# EAGLE design in3watch (EAGLE 6.4)

## Sheet 1 of 4: MCU
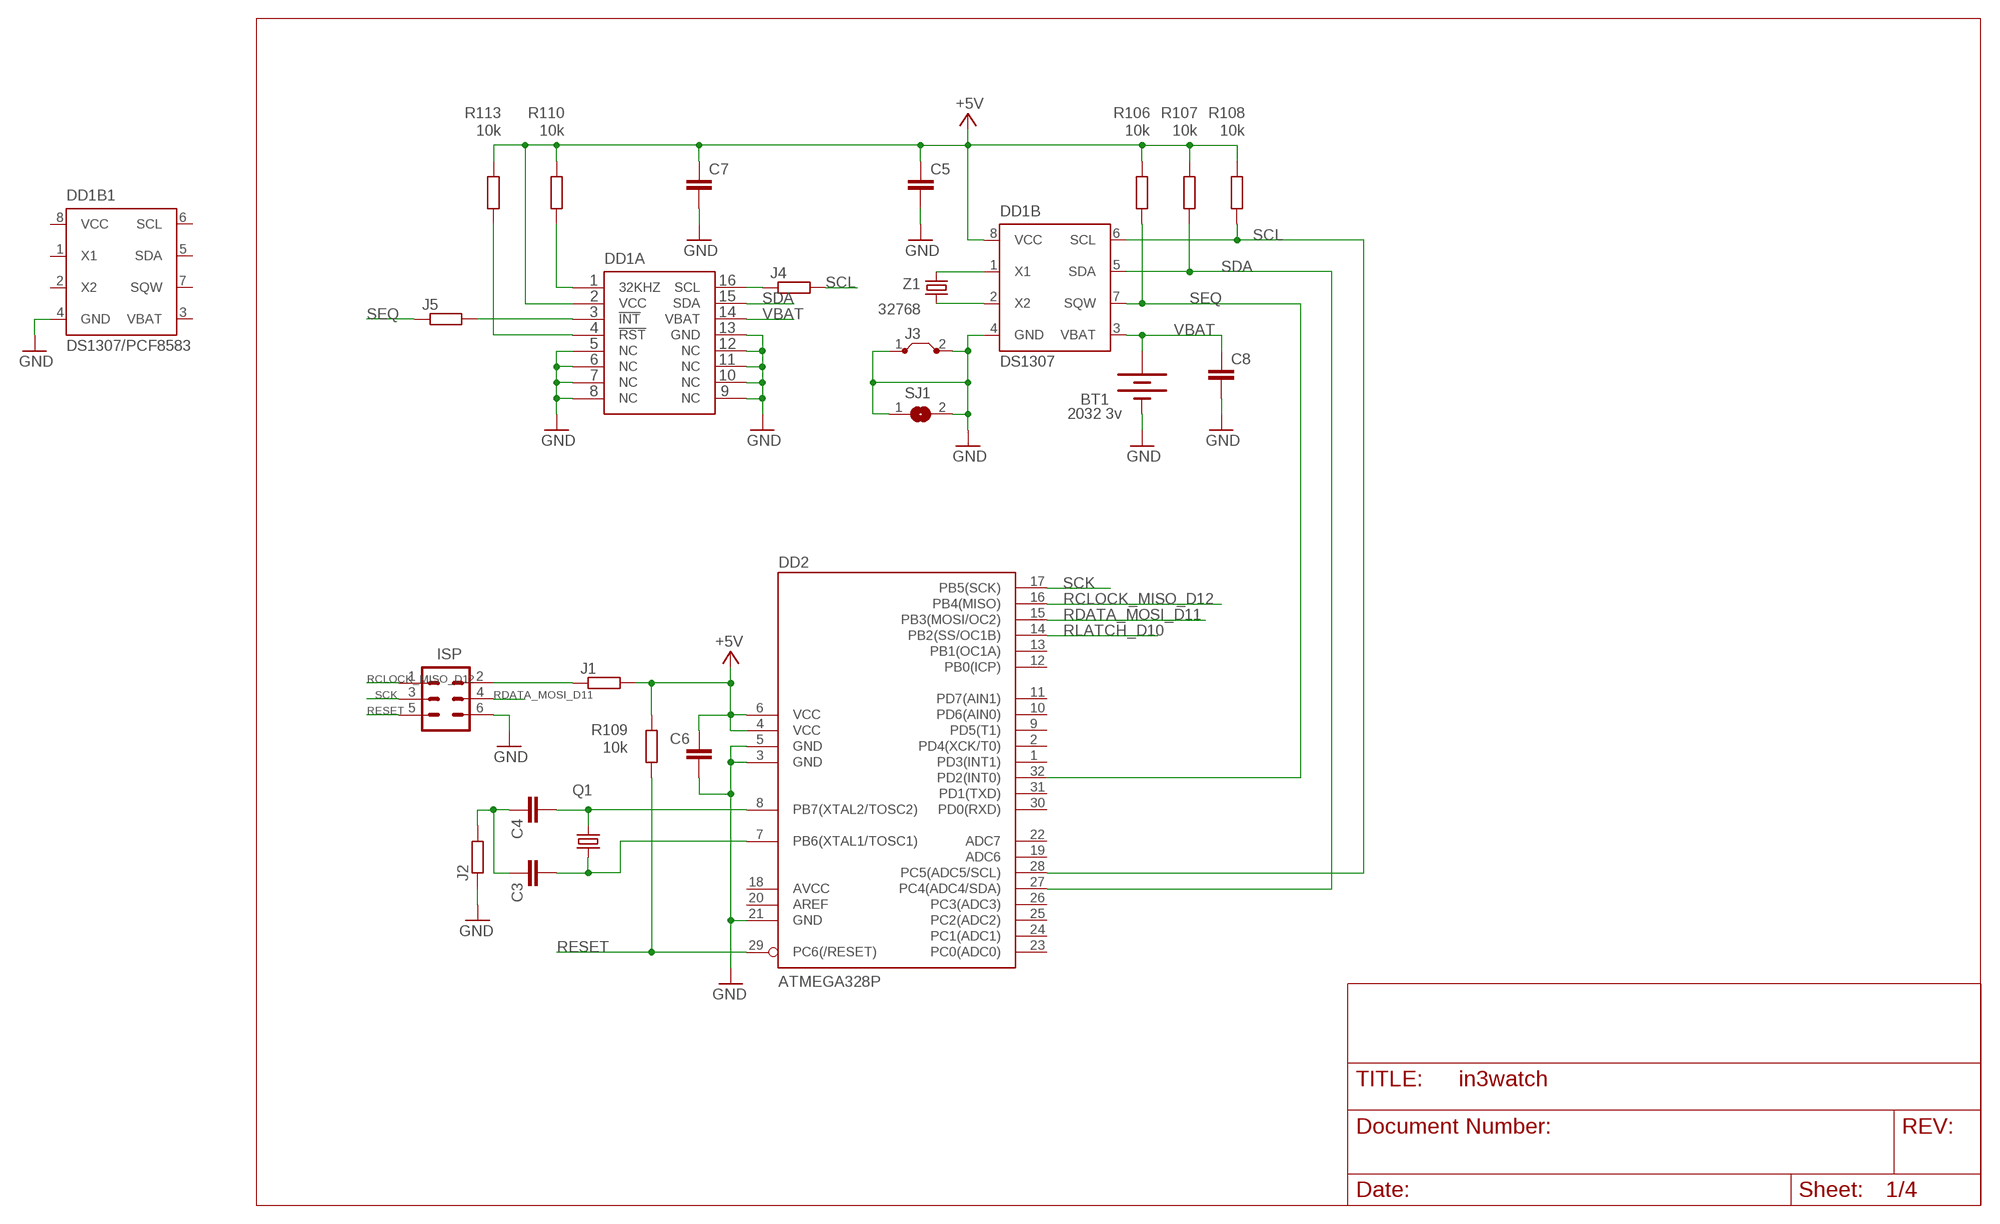
[diagram p0: schematic, sheet 1]

### Parts
BT1  2032 3v  BATTERY-20MM_PTH  [BATTCOM_20MM_PTH]
C3  C-EUC0805  [C0805]
C4  C-EUC0805  [C0805]
C5  C-EUC0805  [C0805]
C6  C-EUC0805  [C0805]
C7  C-EUC0805  [C0805]
C8  C-EUC3225  [C3225]
DD1A  DS3231SOIC-16W  [SOIC-16W]
DD1B  DS1307  [DIL08]
DD1B1  DS1307/PCF8583  [SO8-7_5+SOIC8]
DD2  ATMEGA328P  MEGA8-AI  [TQFP32-08]
ISP  MA03-2  [MA03-2]
J1  R-EU_R1206  [R1206]
J2  R-EU_R1206  [R1206]
J3  J5MM  [05]
J4  R-EU_R1206W  [R1206W]
J5  R-EU_R1206W  [R1206W]
Q1  CRYSTALHC49U70  [HC49U70]
R106  10k  R-EU_R0805  [R0805]
R107  10k  R-EU_R0805  [R0805]
R108  10k  R-EU_R0805  [R0805]
R109  10k  R-EU_R0805  [R0805]
R110  10k  R-EU_R0805  [R0805]
R113  10k  R-EU_R0805  [R0805]
SJ1  SJ  [SJ]
Z1  32768  FC-12M  [FC-12M]

### Nets
+5V: C5.1 C6.1 C7.1 DD1A.2(VCC) DD1B.8(VCC) DD2.4(VCC) DD2.6(VCC) J1.2 R106.2 R107.2 R108.2 R109.2 R110.2 R113.2 ; also sheet 2
+5VISP: ISP.2 J1.1
GND: BT1.2(-) C5.2 C6.2 C7.2 C8.2 DD1A.5(NC) DD1A.6(NC) DD1A.7(NC) DD1A.8(NC) DD1A.9(NC) DD1A.10(NC) DD1A.11(NC) DD1A.12(NC) DD1A.13(GND) DD1B1.4(GND) DD1B.4(GND) DD2.3(GND) DD2.5(GND) DD2.21(GND) ISP.6 J2.1 J3.1 J3.2 SJ1.1 SJ1.2 ; also sheet 2,4
N$31: DD1B.2(X2) Z1.P$1
N$33: DD1B.1(X1) Z1.P$2
N$72: C4.2 DD2.8(PB7(XTAL2/TOSC2)) Q1.1
N$76: C3.1 C4.1 J2.2
N$112: C3.2 DD2.7(PB6(XTAL1/TOSC1)) Q1.2
N$114: DD1A.1(32KHZ) R110.1
N$115: DD1A.4(!RST) R113.1
RCLOCK_MISO_D12: DD2.16(PB4(MISO)) ISP.1
RDATA_MOSI_D11: DD2.15(PB3(MOSI/OC2)) ISP.4
RESET: DD2.29(PC6(/RESET)) ISP.5 R109.1
RLATCH_D10: DD2.14(PB2(SS/OC1B))
SCK: DD2.17(PB5(SCK)) ISP.3
SCL: DD1B.6(SCL) DD2.28(PC5(ADC5/SCL)) J4.2 R108.1
SCL_J: DD1A.16(SCL) J4.1
SDA: DD1A.15(SDA) DD1B.5(SDA) DD2.27(PC4(ADC4/SDA)) R107.1
SEQ: DD1B.7(SQW) DD2.32(PD2(INT0)) J5.1 R106.1
SEQ_J: DD1A.3(!INT) J5.2
VBAT: BT1.1(+) C8.1 DD1A.14(VBAT) DD1B.3(VBAT)
Unconnected: DD1B1.1(X1) DD1B1.2(X2) DD1B1.3(VBAT) DD1B1.5(SDA) DD1B1.6(SCL) DD1B1.7(SQW) DD2.1(PD3(INT1)) DD2.2(PD4(XCK/T0)) DD2.9(PD5(T1)) DD2.10(PD6(AIN0)) DD2.11(PD7(AIN1)) DD2.12(PB0(ICP)) DD2.13(PB1(OC1A)) DD2.19(ADC6) DD2.20(AREF) DD2.22(ADC7) DD2.23(PC0(ADC0)) DD2.24(PC1(ADC1)) DD2.25(PC2(ADC2)) DD2.26(PC3(ADC3)) DD2.30(PD0(RXD)) DD2.31(PD1(TXD))

## Sheet 2 of 4: REG
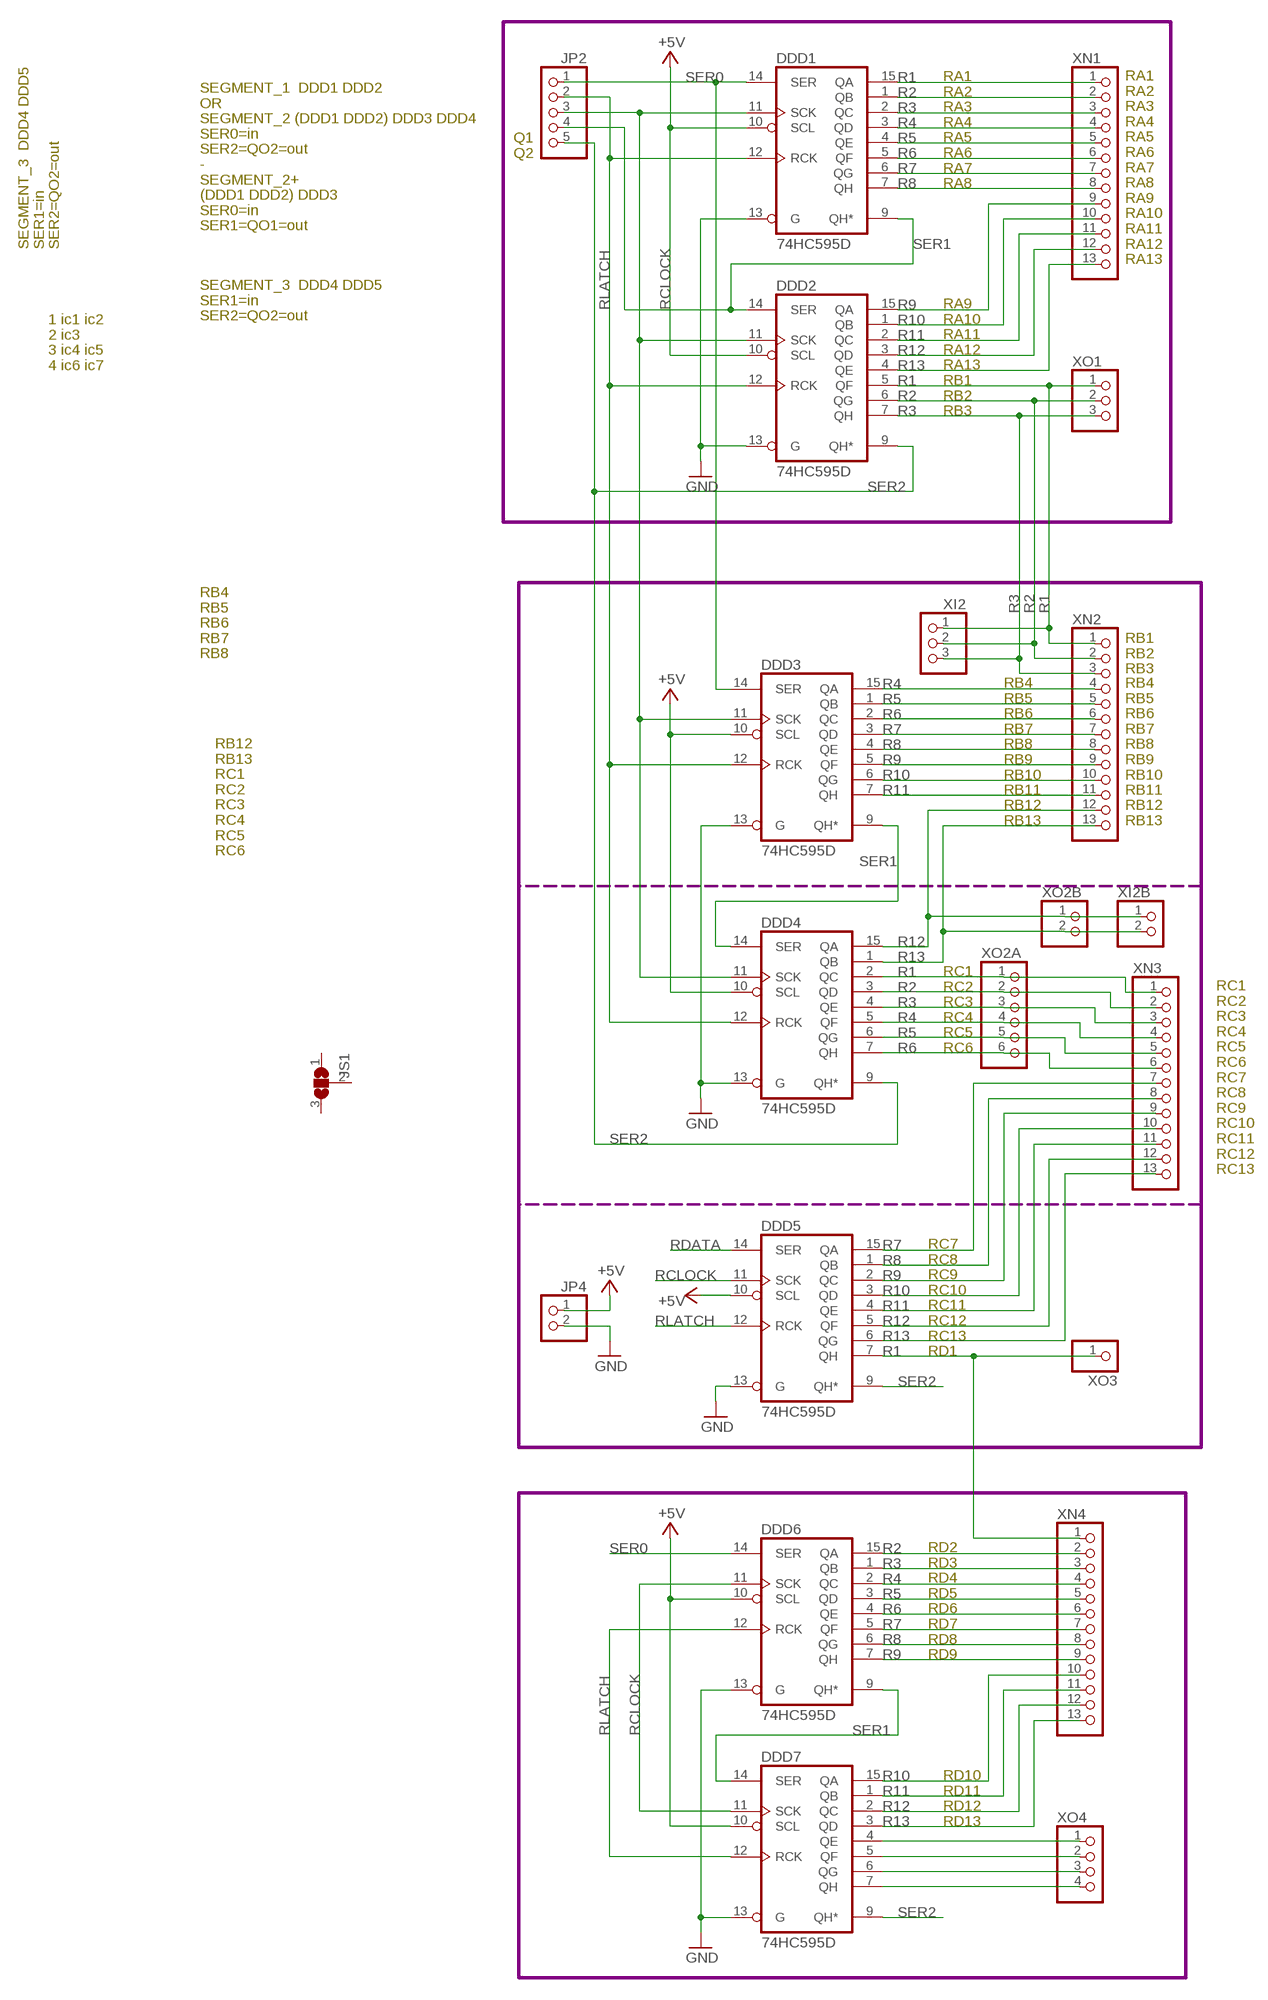
[diagram p1: schematic, sheet 2, part 1 of 2]
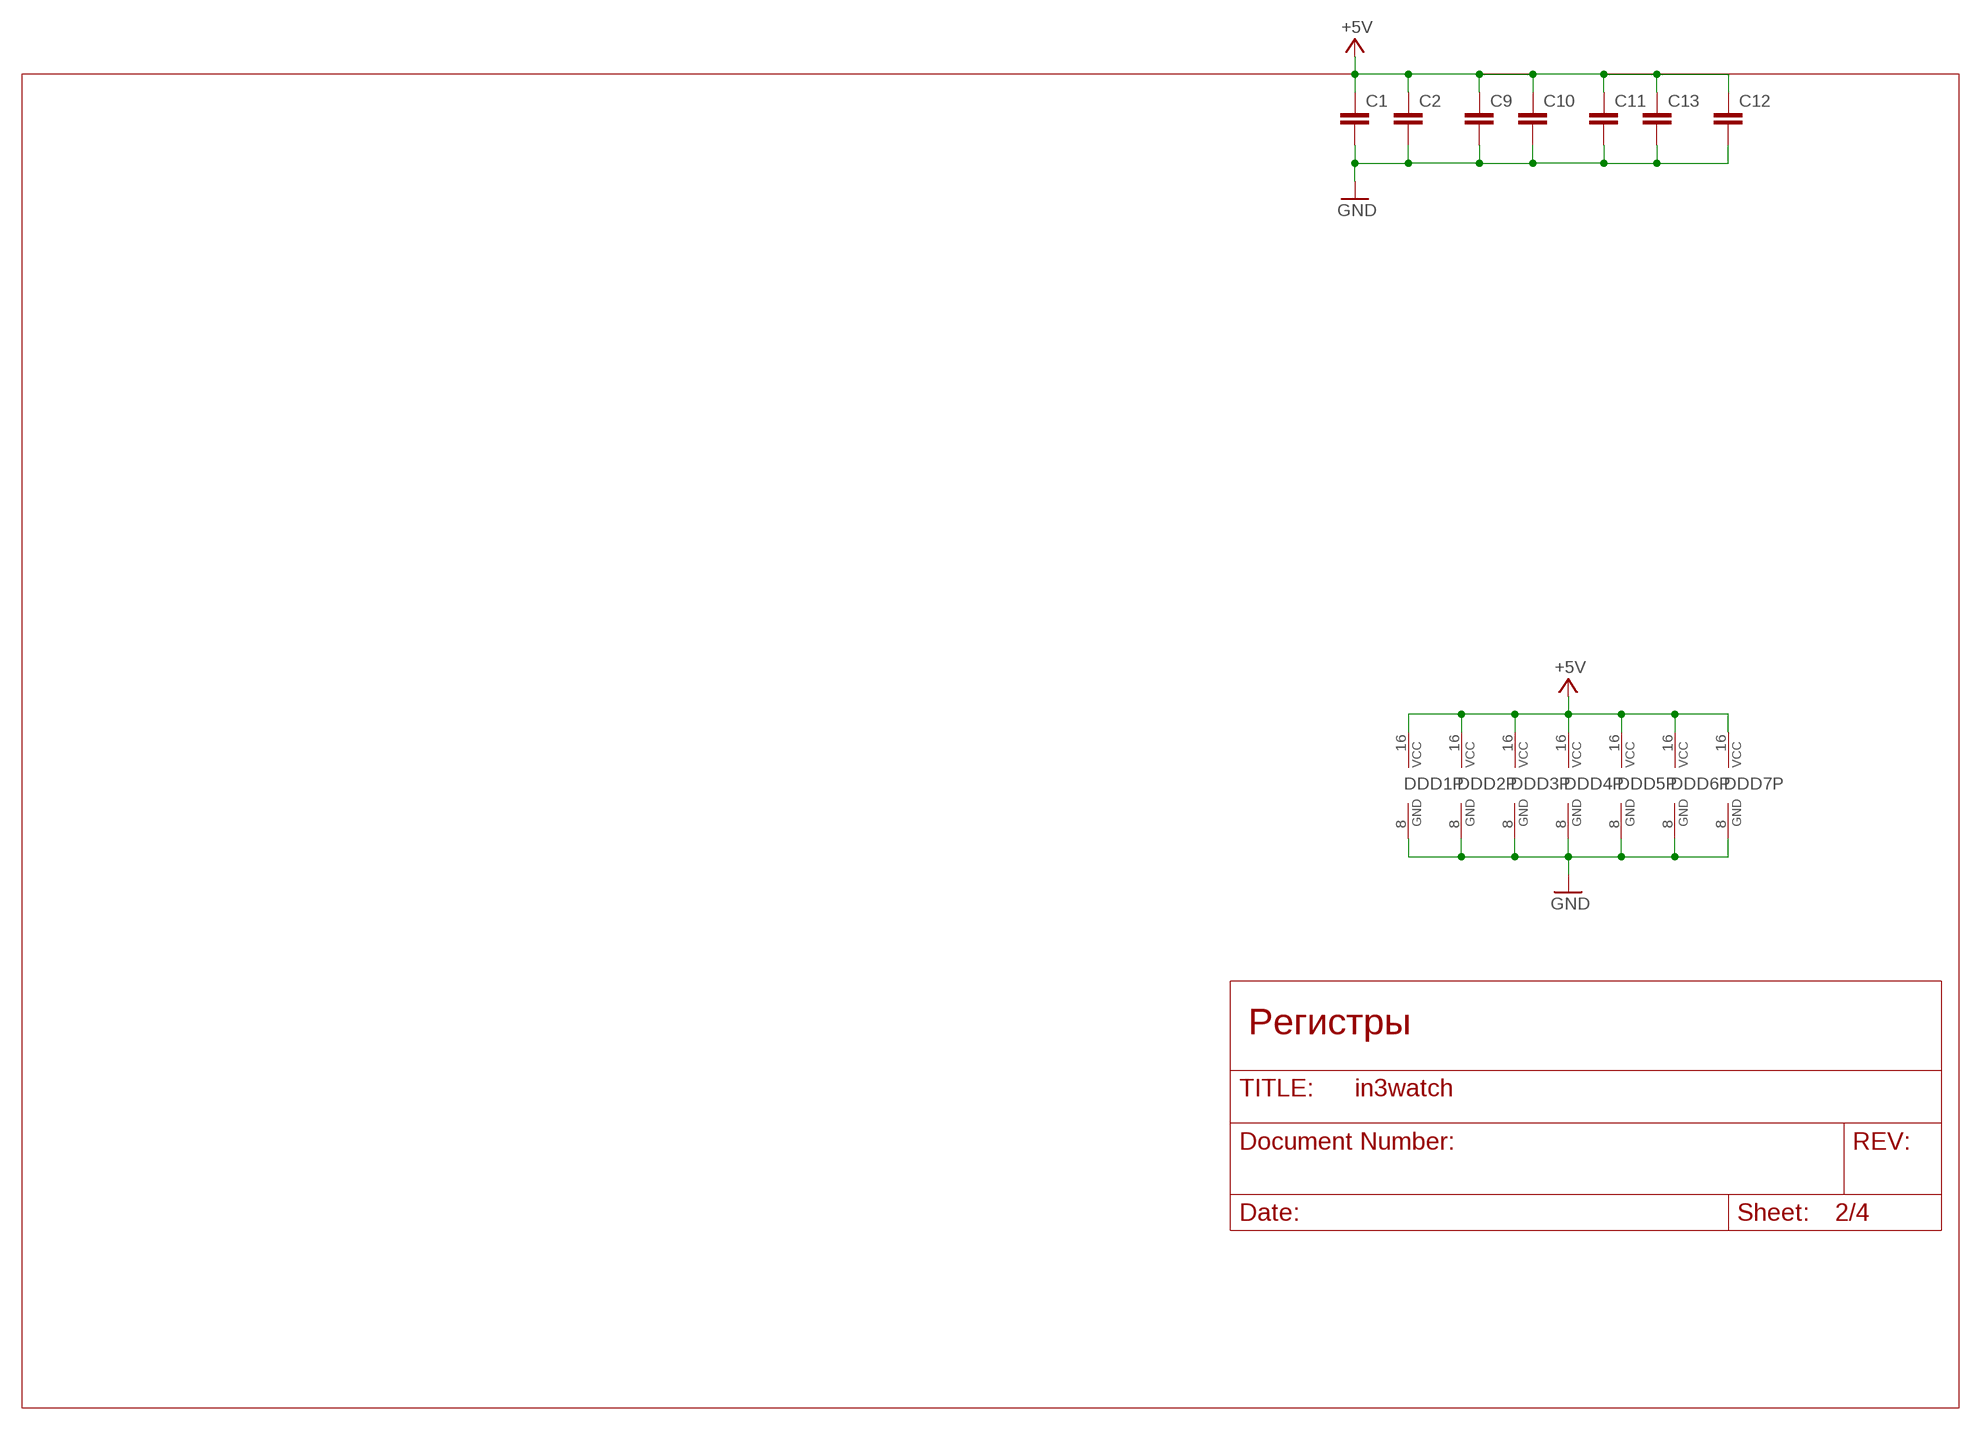
[diagram p2: schematic, sheet 2, part 2 of 2]

### Parts
C1  C-EUC0805  [C0805]
C2  C-EUC0805  [C0805]
C9  C-EUC0805  [C0805]
C10  C-EUC0805  [C0805]
C11  C-EUC0805  [C0805]
C12  C-EUC0805  [C0805]
C13  C-EUC0805  [C0805]
DDD1  74HC595D  [SO16]
DDD2  74HC595D  [SO16]
DDD3  74HC595D  [SO16]
DDD4  74HC595D  [SO16]
DDD5  74HC595D  [SO16]
DDD6  74HC595D  [SO16]
DDD7  74HC595D  [SO16]
JP2  PINHD-1X5  [1X05]
JP4  PINHD-1X2  [2X01]
JS1  SJ2W  [SJ_2]
XI2  PINHD-1X3  [1X03]
XI2B  PINHD-1X2/2  [1X02]
XN1  PINHD-1X13  [1X13]
XN2  PINHD-1X13  [1X13]
XN3  PINHD-1X13  [1X13]
XN4  PINHD-1X13  [1X13]
XO1  PINHD-1X3  [1X03]
XO2A  PINHD-1X6  [1X06]
XO2B  PINHD-1X2/2  [1X02]
XO3  PINHD-1X1  [1X01]
XO4  PINHD-1X4  [1X04]

### Nets
+5V: C1.1 C2.1 C9.1 C10.1 C11.1 C12.1 C13.1 DDD1.10(SCL) DDD1.16(VCC) DDD2.10(SCL) DDD2.16(VCC) DDD3.10(SCL) DDD3.16(VCC) DDD4.10(SCL) DDD4.16(VCC) DDD5.10(SCL) DDD5.16(VCC) DDD6.10(SCL) DDD6.16(VCC) DDD7.10(SCL) DDD7.16(VCC) JP4.1 ; also sheet 1
GND: C1.2 C2.2 C9.2 C10.2 C11.2 C12.2 C13.2 DDD1.8(GND) DDD1.13(G) DDD2.8(GND) DDD2.13(G) DDD3.8(GND) DDD3.13(G) DDD4.8(GND) DDD4.13(G) DDD5.8(GND) DDD5.13(G) DDD6.8(GND) DDD6.13(G) DDD7.8(GND) DDD7.13(G) JP4.2 ; also sheet 1,4
N$17: DDD7.4(QE) XO4.1
N$117: DDD7.5(QF) XO4.2
N$118: DDD7.6(QG) XO4.3
N$119: DDD7.7(QH) XO4.4
R1: DDD1.15(QA) DDD2.5(QF) DDD4.2(QC) DDD5.7(QH) XI2.1 XN1.1 XN2.1 XN3.1 XN4.1 XO1.1 XO2A.1 XO3.1
R2: DDD1.1(QB) DDD2.6(QG) DDD4.3(QD) DDD6.15(QA) XI2.2 XN1.2 XN2.2 XN3.2 XN4.2 XO1.2 XO2A.2
R3: DDD1.2(QC) DDD2.7(QH) DDD4.4(QE) DDD6.1(QB) XI2.3 XN1.3 XN2.3 XN3.3 XN4.3 XO1.3 XO2A.3
R4: DDD1.3(QD) DDD3.15(QA) DDD4.5(QF) DDD6.2(QC) XN1.4 XN2.4 XN3.4 XN4.4 XO2A.4
R5: DDD1.4(QE) DDD3.1(QB) DDD4.6(QG) DDD6.3(QD) XN1.5 XN2.5 XN3.5 XN4.5 XO2A.5
R6: DDD1.5(QF) DDD3.2(QC) DDD4.7(QH) DDD6.4(QE) XN1.6 XN2.6 XN3.6 XN4.6 XO2A.6
R7: DDD1.6(QG) DDD3.3(QD) DDD5.15(QA) DDD6.5(QF) XN1.7 XN2.7 XN3.7 XN4.7
R8: DDD1.7(QH) DDD3.4(QE) DDD5.1(QB) DDD6.6(QG) XN1.8 XN2.8 XN3.8 XN4.8
R9: DDD2.15(QA) DDD3.5(QF) DDD5.2(QC) DDD6.7(QH) XN1.9 XN2.9 XN3.9 XN4.9
R10: DDD2.1(QB) DDD3.6(QG) DDD5.3(QD) DDD7.15(QA) XN1.10 XN2.10 XN3.10 XN4.10
R11: DDD2.2(QC) DDD3.7(QH) DDD5.4(QE) DDD7.1(QB) XN1.11 XN2.11 XN3.11 XN4.11
R12: DDD2.3(QD) DDD4.15(QA) DDD5.5(QF) DDD7.2(QC) XI2B.1 XN1.12 XN2.12 XN3.12 XN4.12 XO2B.1
R13: DDD2.4(QE) DDD4.1(QB) DDD5.6(QG) DDD7.3(QD) XI2B.2 XN1.13 XN2.13 XN3.13 XN4.13 XO2B.2
RCLOCK: DDD1.11(SCK) DDD2.11(SCK) DDD3.11(SCK) DDD4.11(SCK) DDD5.11(SCK) DDD6.11(SCK) DDD7.11(SCK) JP2.3
RDATA: DDD5.14(SER)
RLATCH: DDD1.12(RCK) DDD2.12(RCK) DDD3.12(RCK) DDD4.12(RCK) DDD5.12(RCK) DDD6.12(RCK) DDD7.12(RCK) JP2.2
SER0: DDD1.14(SER) DDD3.14(SER) DDD6.14(SER) JP2.1
SER1: DDD1.9(QH*) DDD2.14(SER) DDD3.9(QH*) DDD4.14(SER) DDD6.9(QH*) DDD7.14(SER) JP2.4
SER2: DDD2.9(QH*) DDD4.9(QH*) DDD5.9(QH*) DDD7.9(QH*) JP2.5
Unconnected: JS1.1 JS1.2 JS1.3

### Notes on the sheet
- SEGMENT_1  DDD1 DDD2
  OR 
  SEGMENT_2 (DDD1 DDD2) DDD3 DDD4
  SER0=in
  SER2=QO2=out
  -
  SEGMENT_2+
  (DDD1 DDD2) DDD3
  SER0=in
  SER1=QO1=out
- Q1
  Q2
- RA1
  RA2
  RA3
  RA4
  RA5
  RA6
  RA7
  RA8
- SEGMENT_3  DDD4 DDD5
  SER1=in
  SER2=QO2=out
- RA1
  RA2
  RA3
  RA4
  RA5
  RA6
  RA7
  RA8
  RA9
  RA10
  RA11
  RA12
  RA13
- SEGMENT_3  DDD4 DDD5
  SER1=in
  SER2=QO2=out
- 1 ic1 ic2
  2 ic3 
  3 ic4 ic5
  4 ic6 ic7
- RA9
  RA10
  RA11
  RA12
  RA13
  RB1
  RB2
  RB3
- RB4
  RB5
  RB6
  RB7
  RB8
- RB1
  RB2
  RB3
- Регистры
- RB4
  RB5
  RB6
  RB7
  RB8
  RB9
  RB10
  RB11
- RB4
  RB5
  RB6
  RB7
  RB8
  RB9
  RB10
  RB11
- RB12
  RB13
- RB12
  RB13
- RB12
  RB13
  RС1
  RС2
  RС3
  RС4
  RС5
  RС6
- RС1
  RС2
  RС3
  RС4
  RС5
  RС6
- RС1
  RС2
  RС3
  RС4
  RС5
  RС6
  RC7
  RC8
  RC9
  RC10
  RC11
  RC12
  RC13
- RC7
  RC8
  RC9
  RC10
  RC11
  RC12
  RC13
  RD1
- RD2
  RD3
  RD4
  RD5
  RD6
  RD7
  RD8
  RD9
- RD10
  RD11
  RD12
  RD13

## Sheet 3 of 4: DSPL
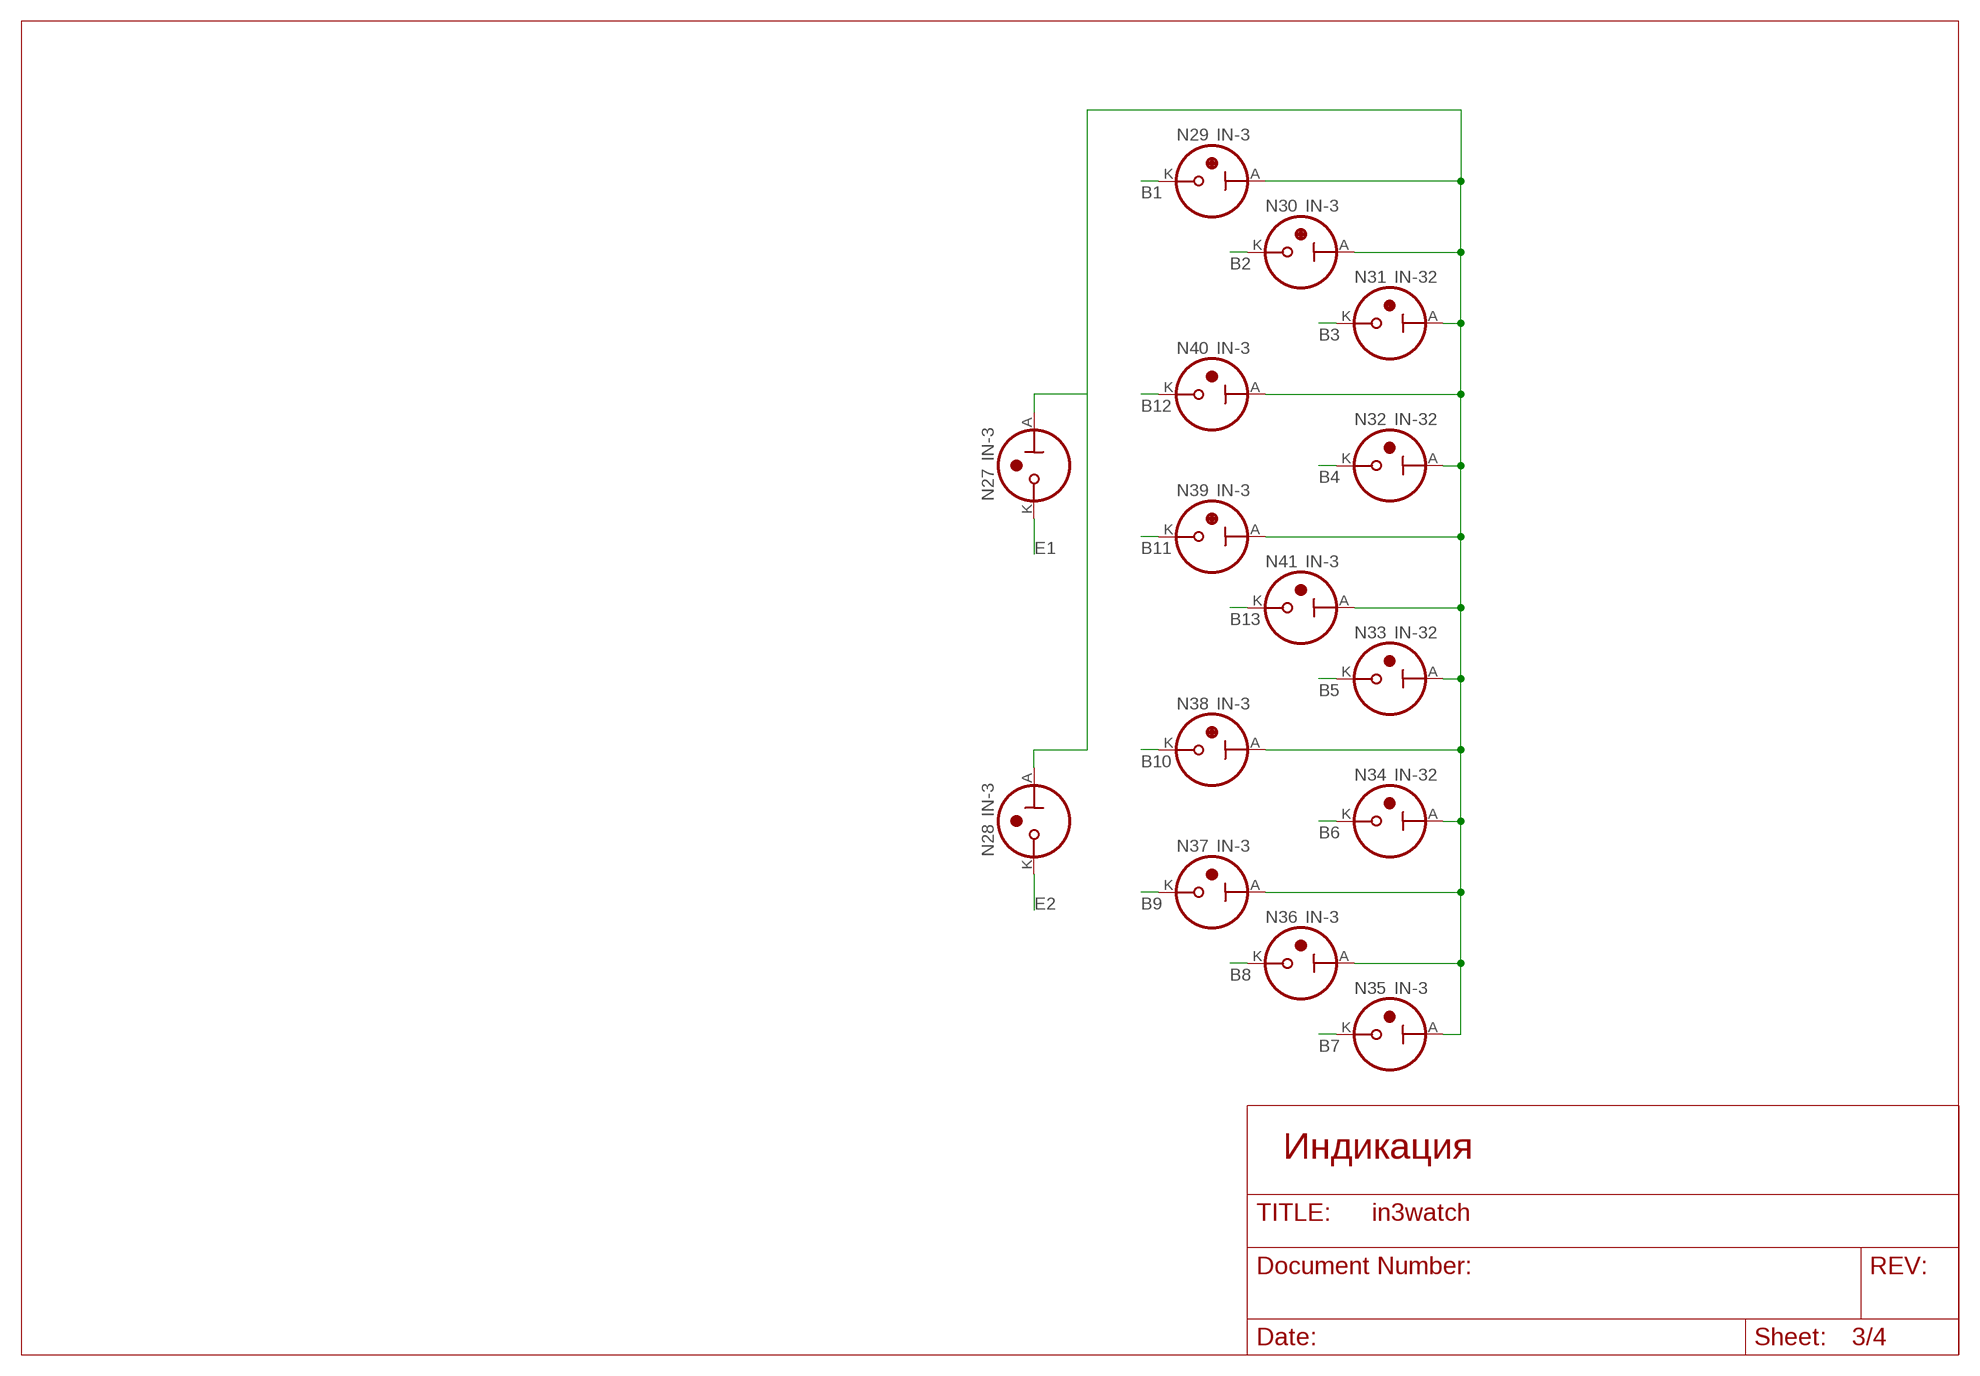
[diagram p3: schematic, sheet 3]

### Parts
N27  IN-3  [IN-3]
N28  IN-3  [IN-3]
N29  IN-3  [IN-3]
N30  IN-3  [IN-3]
N31  IN-32  [IN-3-2]
N32  IN-32  [IN-3-2]
N33  IN-32  [IN-3-2]
N34  IN-32  [IN-3-2]
N35  IN-3  [IN-3]
N36  IN-3  [IN-3]
N37  IN-3  [IN-3]
N38  IN-3  [IN-3]
N39  IN-3  [IN-3]
N40  IN-3  [IN-3]
N41  IN-3  [IN-3]

### Nets
+100V: N27.A N28.A N29.A N30.A N31.A N32.A N33.A N34.A N35.A N36.A N37.A N38.A N39.A N40.A N41.A
B1: N29.K ; also sheet 4
B2: N30.K ; also sheet 4
B3: N31.K ; also sheet 4
B4: N32.K ; also sheet 4
B5: N33.K ; also sheet 4
B6: N34.K ; also sheet 4
B7: N35.K ; also sheet 4
B8: N36.K ; also sheet 4
B9: N37.K ; also sheet 4
B10: N38.K ; also sheet 4
B11: N39.K ; also sheet 4
B12: N40.K ; also sheet 4
B13: N41.K
E1: N27.K ; also sheet 4
E2: N28.K ; also sheet 4

### Notes on the sheet
- Индикация

## Sheet 4 of 4: SW.1
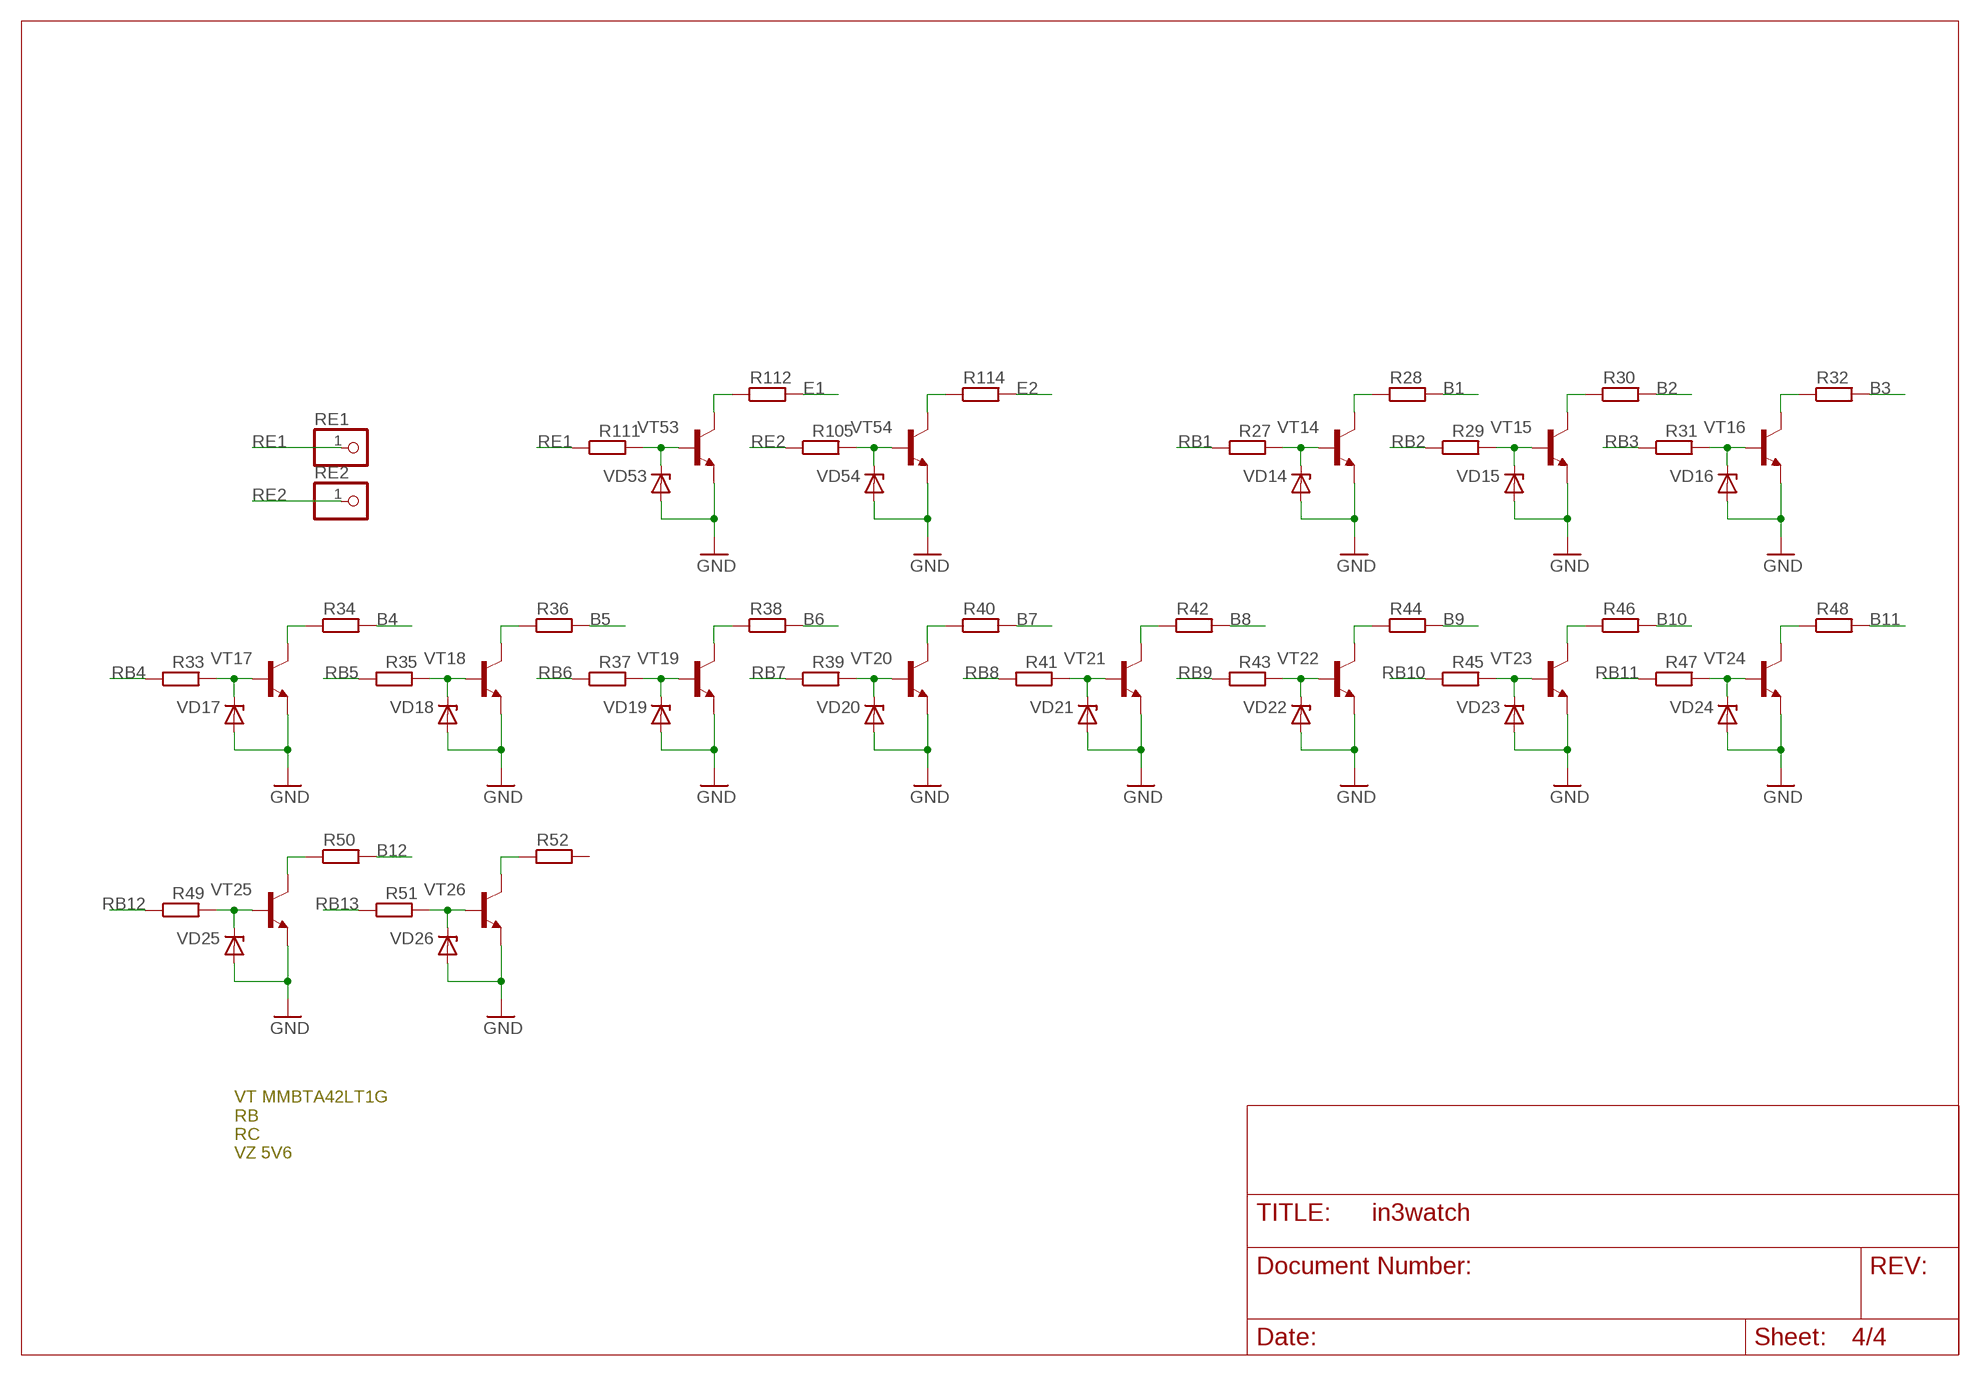
[diagram p4: schematic, sheet 4]

### Parts
R27  R-EU_R0805  [R0805]
R28  R-EU_0207/12  [0207/12]
R29  R-EU_R0805  [R0805]
R30  R-EU_0207/12  [0207/12]
R31  R-EU_R0805  [R0805]
R32  R-EU_0207/12  [0207/12]
R33  R-EU_R0805  [R0805]
R34  R-EU_0207/12  [0207/12]
R35  R-EU_M1206  [M1206]
R36  R-EU_0207/12  [0207/12]
R37  R-EU_R0805  [R0805]
R38  R-EU_0207/12  [0207/12]
R39  R-EU_R0805  [R0805]
R40  R-EU_0207/12  [0207/12]
R41  R-EU_R1206W  [R1206W]
R42  R-EU_0207/12  [0207/12]
R43  R-EU_R1206W  [R1206W]
R44  R-EU_0207/12  [0207/12]
R45  R-EU_R1206W  [R1206W]
R46  R-EU_0207/12  [0207/12]
R47  R-EU_R0805  [R0805]
R48  R-EU_0207/10  [0207/10]
R49  R-EU_R0805  [R0805]
R50  R-EU_0207/12  [0207/12]
R51  R-EU_R0805  [R0805]
R52  R-EU_0207/12  [0207/12]
R105  R-EU_R0805  [R0805]
R111  R-EU_R0805  [R0805]
R112  R-EU_M0805  [M0805]
R114  R-EU_M0805  [M0805]
RE1  PINHD-1X1  [1X01]
RE2  PINHD-1X1  [1X01]
VD14  ZENER-DIODESOD80C  [SOD80C]
VD15  ZENER-DIODESOD80C  [SOD80C]
VD16  ZENER-DIODESOD80C  [SOD80C]
VD17  ZENER-DIODESOD80C  [SOD80C]
VD18  ZENER-DIODESOD80C  [SOD80C]
VD19  ZENER-DIODESOD80C  [SOD80C]
VD20  ZENER-DIODESOD80C  [SOD80C]
VD21  ZENER-DIODESOD80C  [SOD80C]
VD22  ZENER-DIODESOD80C  [SOD80C]
VD23  ZENER-DIODESOD80C  [SOD80C]
VD24  ZENER-DIODESOD80C  [SOD80C]
VD25  ZENER-DIODESOD80C  [SOD80C]
VD26  ZENER-DIODESOD80C  [SOD80C]
VD53  ZENER-DIODESOD80C  [SOD80C]
VD54  ZENER-DIODESOD80C  [SOD80C]
VT14  BC849SMD  [SOT23-BEC]
VT15  BC849SMD  [SOT23-BEC]
VT16  BC849SMD  [SOT23-BEC]
VT17  BC849SMD  [SOT23-BEC]
VT18  BC849SMD  [SOT23-BEC]
VT19  BC849SMD  [SOT23-BEC]
VT20  BC849SMD  [SOT23-BEC]
VT21  BC849SMD  [SOT23-BEC]
VT22  BC849SMD  [SOT23-BEC]
VT23  BC849SMD  [SOT23-BEC]
VT24  BC849SMD  [SOT23-BEC]
VT25  BC849SMD  [SOT23-BEC]
VT26  BC849SMD  [SOT23-BEC]
VT53  BC849SMD  [SOT23-BEC]
VT54  BC849SMD  [SOT23-BEC]

### Nets
B1: R28.2 ; also sheet 3
B2: R30.2 ; also sheet 3
B3: R32.2 ; also sheet 3
B4: R34.2 ; also sheet 3
B5: R36.2 ; also sheet 3
B6: R38.2 ; also sheet 3
B7: R40.2 ; also sheet 3
B8: R42.2 ; also sheet 3
B9: R44.2 ; also sheet 3
B10: R46.2 ; also sheet 3
B11: R48.2 ; also sheet 3
B12: R50.2 ; also sheet 3
E1: R112.2 ; also sheet 3
E2: R114.2 ; also sheet 3
GND: VD14.A VD15.A VD16.A VD17.A VD18.A VD19.A VD20.A VD21.A VD22.A VD23.A VD24.A VD25.A VD26.A VD53.A VD54.A VT14.E VT15.E VT16.E VT17.E VT18.E VT19.E VT20.E VT21.E VT22.E VT23.E VT24.E VT25.E VT26.E VT53.E VT54.E ; also sheet 1,2
N$3: R34.1 VT17.C
N$16: R28.1 VT14.C
N$30: R27.2 VD14.C VT14.B
N$32: R33.2 VD17.C VT17.B
N$34: R30.1 VT15.C
N$35: R29.2 VD15.C VT15.B
N$36: R32.1 VT16.C
N$37: R31.2 VD16.C VT16.B
N$38: R36.1 VT18.C
N$39: R35.2 VD18.C VT18.B
N$40: R38.1 VT19.C
N$41: R37.2 VD19.C VT19.B
N$42: R40.1 VT20.C
N$43: R39.2 VD20.C VT20.B
N$44: R42.1 VT21.C
N$45: R41.2 VD21.C VT21.B
N$46: R44.1 VT22.C
N$47: R43.2 VD22.C VT22.B
N$48: R46.1 VT23.C
N$49: R45.2 VD23.C VT23.B
N$50: R48.1 VT24.C
N$51: R47.2 VD24.C VT24.B
N$52: R50.1 VT25.C
N$53: R49.2 VD25.C VT25.B
N$54: R52.1 VT26.C
N$55: R51.2 VD26.C VT26.B
N$73: R112.1 VT53.C
N$84: R111.2 VD53.C VT53.B
N$113: R114.1 VT54.C
N$116: R105.2 VD54.C VT54.B
RB1: R27.1
RB2: R29.1
RB3: R31.1
RB4: R33.1
RB5: R35.1
RB6: R37.1
RB7: R39.1
RB8: R41.1
RB9: R43.1
RB10: R45.1
RB11: R47.1
RB12: R49.1
RB13: R51.1
RE1: R111.1 RE1.1
RE2: R105.1 RE2.1
Unconnected: R52.2

### Notes on the sheet
- VT MMBTA42LT1G
  RB
  RC
  VZ 5V6

## Power pins joined to a net without a drawn wire
AVCC: DD2.18(AVCC)
VCC: DD1B1.8(VCC)

## Library data of the parts
BT1 = SparkFun-Batteries:BATTERY: Battery - Single Cell A variety of battery chemistries, sizes, and footprints. Device List: 20MM_PTH - Coin Cell Battery Holder - 20mm (PTH) <https://www.sparkfun.com/products/783> 6.8MM_PTH - Coin Cell Battery Holder - 6.8MM(SMD) <https://www.digikey.com/product-detail/en/seiko-instruments/MS621FE-FL11E/728-1057-ND/1889208?WT.srch=1&gclid=CNOQ5a6LzdQCFZS2wAodXCkE0g> 12MM_SMD - Coin Cell Battery Holder - 12mm (SMD) <https://www.sparkfun.com/products/10592> 12MM_PTH - Coin Cell Battery Holder - 12mm (PTH) <https://www.sparkfun.com/products/7948> 20MM_SMD - 20mm Coin Cell Battery Holder (SMD) (2 legs) Used on the Big Time Watch Kit <https://www.sparkfun.com/products/11734> 20MM_SMD_4LEGS - Coin Cell Battery Holder - 20mm (SMD) <https://www.sparkfun.com/products/11892> 20MM_SMD_4LEGS_OVERPASTE - Coin Cell Battery Holder - 20mm (SMD) <https://www.sparkfun.com/products/11892> (Over-paste on the legs) 24.5MM_PTH - Coin Cell Battery Holder - 24.5mm (PTH) <https://www.sparkfun.com/products/8863> 9V - 9V Battery Holder - PC Mount Used on the SparkFun SparkPunk Sound Kit <https://www.sparkfun.com/products/11177> and SparkFun SparkPunk Sequencer Kit <https://www.sparkfun.com/products/12707> 18650 - Battery Holder - 18650 (PTH) <https://www.sparkfun.com/products/13113> AA - Battery Holder - 1xAA (PTH) <https://www.sparkfun.com/products/7949> AAA - Battery Holder - 1xAAA (PTH) <https://www.sparkfun.com/products/12718> AA_KIT - Battery Holder - 1xAA (PTH) <https://www.sparkfun.com/products/7949> Special kit package - pads only have exposed copper on one side of the board. AAA_KIT - Battery Holder - 1xAAA (PTH) <https://www.sparkfun.com/products/12718> Special kit package - pads only have exposed copper on one side of the board.; PROD_ID: BATT-09031; SF_SKU: PRT-00783
C1-C13 = rcl:C-EU: CAPACITOR, European symbol
DD1A = DS3231_industrialberry:DS3231
DD1B DD1B1 = ds1307_pcf8583:DS1307: I2C-Bus CLOCK/CALENDAR
DD2 = atmel:MEGA8: MICROCONTROLLER 8 Kbytes FLASH, 1 kbytes SRAM, 512 bytes EEPROM, USART, 6-channel 10 bit ADC, 2-channel 8 bit ADC Pin compatible with Atmega48, ATMega88, ATMega168 Source: avr.lbr; MPN: ATMEGA8-16AU; OC_FARNELL: 9171371; OC_NEWARK: 73M8863
DDD1-DDD7 = 74xx-eu:74*595: 8-bit SHIFT REGISTER, output latch
ISP = con-lstb:MA03-2: PIN HEADER
J1 J2 J4 J5 R27-R52 R105-R114 = rcl:R-EU_: RESISTOR, European symbol
J3 = in3wlbr:J: Bridge
JP2 = Разъёмы штырьковые 2.54мм:PINHD-1X5: PIN HEADER
JP4 XI2B XO2B = Разъёмы штырьковые 2.54мм:PINHD-1X2: PIN HEADER
JS1 = jumper:SJ2W: SMD solder JUMPER
N27-N30 N35-N41 = in3:IN-3: IN-3: nixie bulb
N31-N34 = in3-mod:IN-3: IN-3: nixie bulb
Q1 = crystal:CRYSTAL: CRYSTAL; OC_FARNELL: unknown; OC_NEWARK: unknown
RE1 RE2 = pinhead:PINHD-1X1: PIN HEADER
SJ1 = jumper:SJ: SMD solder JUMPER
VD14-VD26 VD53 VD54 = diode:ZENER-DIODE: Z-Diode
VT14-VT26 VT53 VT54 = transistor-npn:BC849*: NPN Transistor
XI2 XO1 = Разъёмы штырьковые 2.54мм:PINHD-1X3: PIN HEADER
XN1-XN4 = Разъёмы штырьковые 2.54мм:PINHD-1X13: PIN HEADER
XO2A = Разъёмы штырьковые 2.54мм:PINHD-1X6: PIN HEADER
XO3 = Разъёмы штырьковые 2.54мм:PINHD-1X1: PIN HEADER
XO4 = Разъёмы штырьковые 2.54мм:PINHD-1X4: PIN HEADER
Z1 = zq:FC-12M: kHz RANGE CRYSTAL UNIT LOW PROFILE SMD Source: Epson Toyocom FC-12M.pdf

## Board
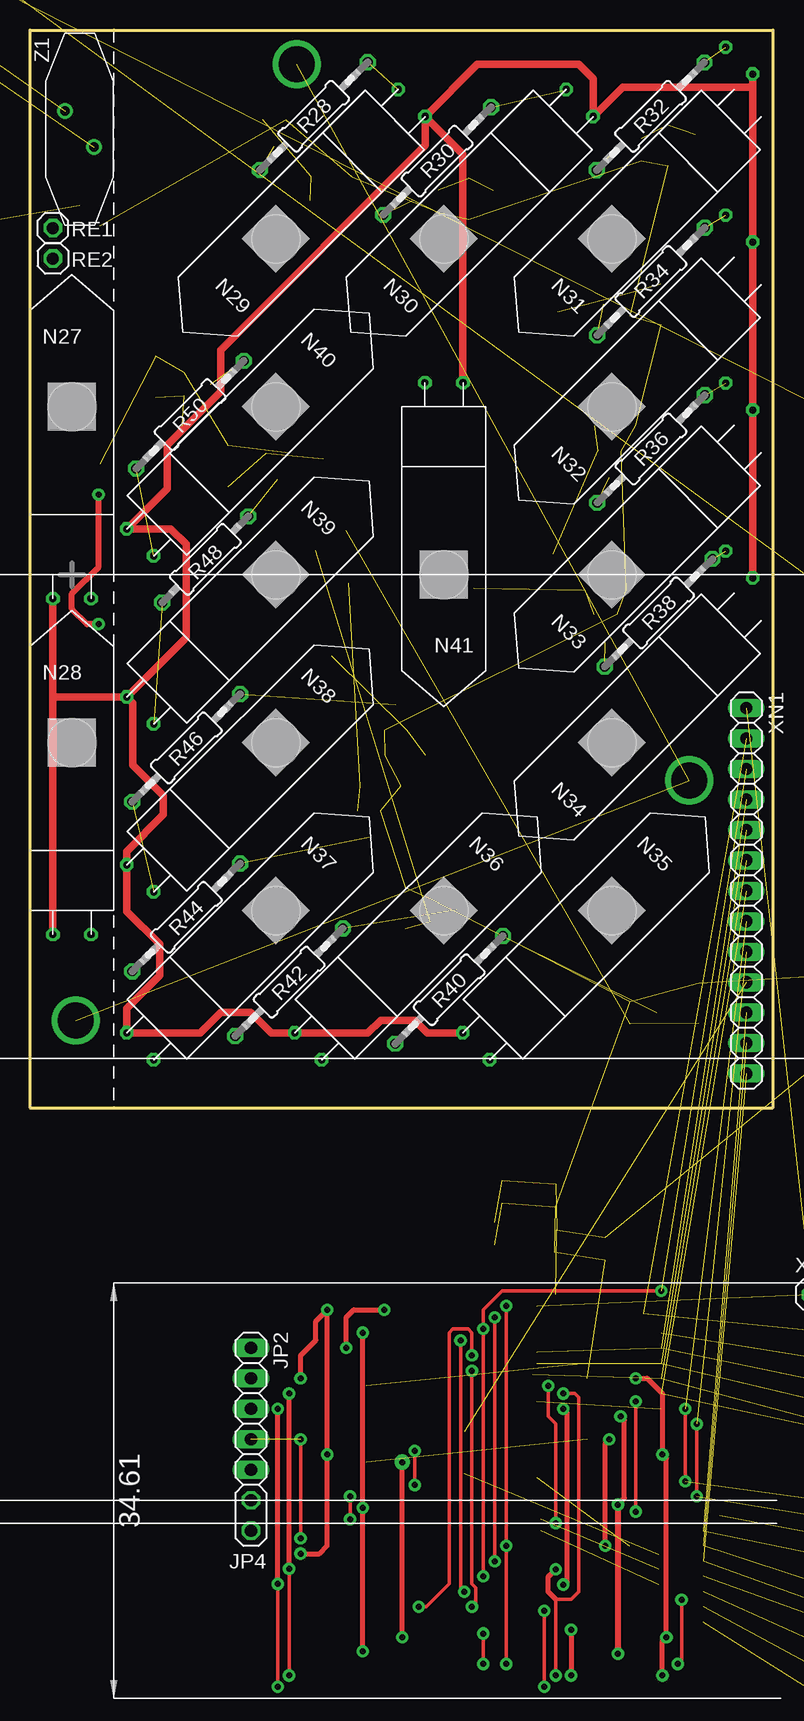
[diagram p5: board, top side]
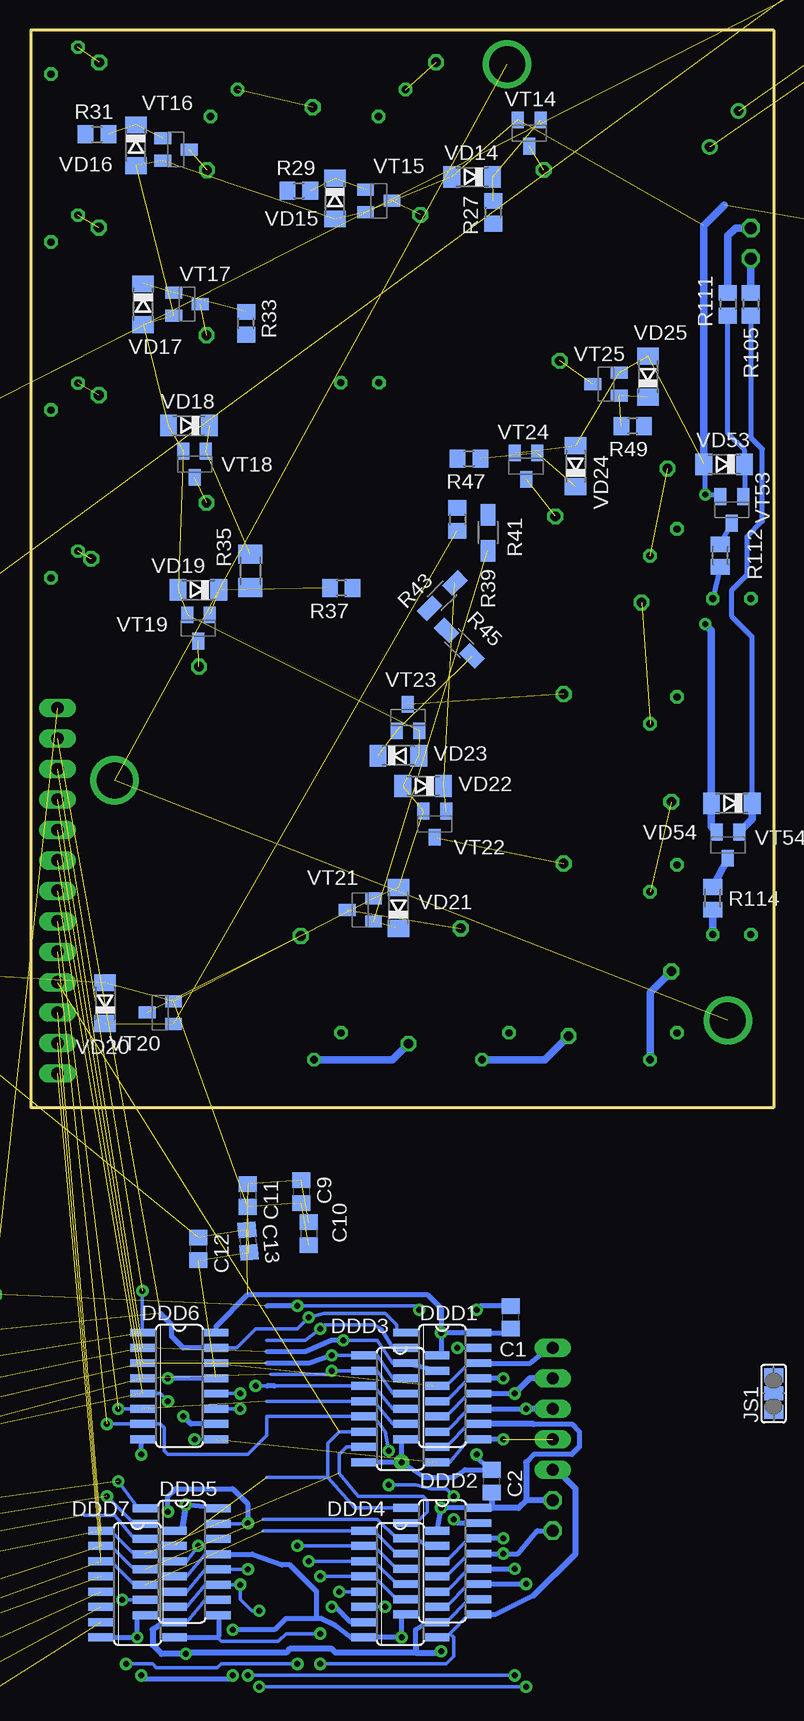
[diagram p6: board, bottom side, seen from below]

Size 61.91 x 89.85 mm. Coordinates in mm from the lower left corner, seen from the top.
Outline: 0,89.85 6.99,89.85 61.91,89.85 61.91,0 6.99,0 0,0 0,89.85
Copper layers (1*16): Top 0.035mm / dielectric 1.5mm / Bottom 0.035mm
Design rules "default_P": minimum track width 10mil, minimum drill 0.5mm, track to track 8mil, track to pad 8mil, pad to pad 8mil, via to via 8mil, smd to smd 8mil, copper to edge 40mil, drill to drill 8mil, minimum pad ring 10mil, minimum via ring 8mil, stop-mask expansion 4mil, vias tented up to drill 0mil, thermal gap 10mil

### Footprints (pad centres in the part's own frame; a part is rotated, then mirrored left to right if it is on the bottom)
BATTCOM_20MM_PTH = drill 1.3: 1 11.85,0; 2 -8.15,0
C0805 = smd 1.3 x 1.5: 1 -0.95,0; 2 0.95,0
C3225 = smd 1.6 x 2.7: 1 -1.4,0; 2 1.4,0
SOIC-16W = smd 0.6 x 2.2: 1 -4.445,-4.6; 2 -3.175,-4.6; 3 -1.905,-4.6; 4 -0.635,-4.6; 5 0.635,-4.6; 6 1.905,-4.6; 7 3.175,-4.6; 8 4.445,-4.6; 9 4.445,4.6; 10 3.175,4.6; 11 1.905,4.6; 12 0.635,4.6; 13 -0.635,4.6; 14 -1.905,4.6; 15 -3.175,4.6; 16 -4.445,4.6
DIL08 = drill 0.813 square: 1 -3.81,-3.81 | drill 0.813 octagon: 2 -1.27,-3.81; 3 1.27,-3.81; 4 3.81,-3.81; 5 3.81,3.81; 6 1.27,3.81; 7 -1.27,3.81 | drill 0.813: 8 -3.81,3.81
SO8-7_5+SOIC8 = smd 0.8 x 4.345: 1 -1.905,-3.672; 2 -0.635,-3.672; 3 0.635,-3.672; 4 1.905,-3.672; 5 1.905,3.672; 6 0.635,3.672; 7 -0.635,3.672; 8 -1.905,3.672
TQFP32-08 = smd 1.27 x 0.559: 1 -4.293,2.8; 2 -4.293,2; 3 -4.293,1.2; 4 -4.293,0.4; 5 -4.293,-0.4; 6 -4.293,-1.2; 7 -4.293,-2; 8 -4.293,-2.8; 17 4.293,-2.8; 18 4.293,-2; 19 4.293,-1.2; 20 4.293,-0.4; 21 4.293,0.4; 22 4.293,1.2; 23 4.293,2; 24 4.293,2.8 | smd 0.559 x 1.27: 9 -2.8,-4.293; 10 -2,-4.293; 11 -1.2,-4.293; 12 -0.4,-4.293; 13 0.4,-4.293; 14 1.2,-4.293; 15 2,-4.293; 16 2.8,-4.293; 25 2.8,4.293; 26 2,4.293; 27 1.2,4.293; 28 0.4,4.293; 29 -0.4,4.293; 30 -1.2,4.293; 31 -2,4.293; 32 -2.8,4.293
SO16 = smd 0.66 x 2.032: 1 -4.445,-3.073; 2 -3.175,-3.073; 3 -1.905,-3.073; 4 -0.635,-3.073; 5 0.635,-3.073; 6 1.905,-3.073; 7 3.175,-3.073; 8 4.445,-3.073; 9 4.445,3.073; 10 3.175,3.073; 11 1.905,3.073; 12 0.635,3.073; 13 -0.635,3.073; 14 -1.905,3.073; 15 -3.175,3.073; 16 -4.445,3.073
MA03-2 = drill 1.016: 1 -2.54,-1.27 | drill 1.016 octagon: 2 -2.54,1.27; 3 0,-1.27; 4 0,1.27; 5 2.54,-1.27; 6 2.54,1.27
R1206 = smd 1.6 x 1.803: 1 -1.422,0; 2 1.422,0
05 = drill 0.813 pad 1.6 octagon: 1 -0.04,0; 2 4.04,0
R1206W = smd 1.8 x 1.2: 1 -1.499,0; 2 1.499,0
1X05 = drill 1.016 long: 1 -5.08,0; 2 -2.54,0; 3 0,0; 4 2.54,0; 5 5.08,0
2X01 = drill 1.016 octagon: 1 -1.27,-1.27; 2 -1.27,1.27
SJ_2 = smd 1.168 x 1.6: 1 -1.524,0; 2 0,0; 3 1.524,0
IN-3 = drill 0.6 octagon: A -1.587,-16; K 1.587,-16
IN-3-2 = drill 0.6 octagon: A 1.413,-18; K 4.588,-18
HC49U70 = drill 0.813: 1 -2.413,0; 2 2.413,0
R0805 = smd 1.3 x 1.5: 1 -0.95,0; 2 0.95,0
0207/12 = drill 0.813 octagon: 1 -6.35,0; 2 6.35,0
M1206 = smd 1.6 x 2: 1 -1.4,0; 2 1.4,0
0207/10 = drill 0.813 octagon: 1 -5.08,0; 2 5.08,0
M0805 = smd 1.3 x 1.6: 1 -0.95,0; 2 0.95,0
1X01 = drill 1.016 octagon: 1 0,0
SJ = smd 1.168 x 1.6: 1 -0.762,0; 2 0.762,0
SOD80C = smd 1.4 x 1.8: A 1.7,0; C -1.7,0
SOT23-BEC = smd 1 x 1.4: B -0.95,-1.1; C 0,1.1; E 0.95,-1.1
1X03 = drill 1.016 long: 1 -2.54,0; 2 0,0; 3 2.54,0
1X02 = drill 1.016 long: 1 -1.27,0; 2 1.27,0
1X13 = drill 1.016 long: 1 -15.24,0; 2 -12.7,0; 3 -10.16,0; 4 -7.62,0; 5 -5.08,0; 6 -2.54,0; 7 0,0; 8 2.54,0; 9 5.08,0; 10 7.62,0; 11 10.16,0; 12 12.7,0; 13 15.24,0
1X06 = drill 1.016 long: 1 -6.35,0; 2 -3.81,0; 3 -1.27,0; 4 1.27,0; 5 3.81,0; 6 6.35,0
1X04 = drill 1.016 long: 1 -3.81,0; 2 -1.27,0; 3 1.27,0; 4 3.81,0
FC-12M = drill 0.8: P$1 1.5,1.2; P$2 -1.5,-1.2

### Placement (x,y rotation side)
BT1  107.16,17.46 350 top  (outside the outline)
C1  21.91,-17.46 90 bottom  (outside the outline)
C2  23.5,-31.11 90 bottom  (outside the outline)
C3  143.03,60.64 180 bottom  (outside the outline)
C4  143.19,62.87 180 bottom  (outside the outline)
C5  82.39,59.06 0 bottom  (outside the outline)
C6  143.51,55.56 270 bottom  (outside the outline)
C7  71.28,11.27 0 bottom  (outside the outline)
C8  78.26,23.02 0 bottom  (outside the outline)
C9  39.37,-6.98 270 bottom  (outside the outline)
C10  38.73,-10.48 270 bottom  (outside the outline)
C11  43.81,-7.3 270 bottom  (outside the outline)
C12  47.94,-11.75 270 bottom  (outside the outline)
C13  43.81,-11.11 275 bottom  (outside the outline)
DD1A  88.74,41.28 0 bottom  (outside the outline)
DD1B  -27.06,108.84 0 top  (outside the outline)
DD1B1  88.58,45.72 0 bottom  (outside the outline)
DD2  92.8,74.67 90 bottom  (outside the outline)
DDD1  27.62,-23.18 270 bottom  (outside the outline)
DDD2  27.62,-37.78 270 bottom  (outside the outline)
DDD3  31.11,-25.08 270 bottom  (outside the outline)
DDD4  31.11,-39.69 270 bottom  (outside the outline)
DDD5  49.33,-37.83 270 bottom  (outside the outline)
DDD6  49.53,-23.18 270 bottom  (outside the outline)
DDD7  53.02,-39.69 270 bottom  (outside the outline)
ISP  129.21,73 270 top  (outside the outline)
J1  138.75,63.82 180 bottom  (outside the outline)
J2  141.61,56.83 90 bottom  (outside the outline)
J3  -26.99,95.73 355 top  (outside the outline)
J4  87.15,83.66 0 bottom  (outside the outline)
J5  125.41,49.53 270 bottom  (outside the outline)
JP2  18.41,-25.08 270 top  (outside the outline)
JP4  17.14,-33.97 180 top  (outside the outline)
JS1  0,-23.81 90 bottom  (outside the outline)
N27  3.49,58.45 0 top
N28  3.49,30.45 0 top
N29  20.49,72.45 135 top
N30  34.49,72.45 135 top
N31  48.49,72.45 135 top
N32  48.49,58.45 135 top
N33  48.49,44.45 135 top
N34  48.49,30.45 135 top
N35  48.49,16.45 315 top
N36  34.49,16.45 315 top
N37  20.49,16.45 315 top
N38  20.49,30.45 315 top
N39  20.49,44.45 315 top
N40  20.49,58.45 315 top
N41  34.49,44.45 180 top
Q1  144.99,60.92 245 top  (outside the outline)
R27  23.36,74.66 90 bottom
R28  23.65,82.67 45 top
R29  39.57,76.47 0 bottom
R30  33.94,78.93 45 top
R31  56.4,81.15 0 bottom
R32  51.71,82.66 45 top
R33  43.97,65.41 90 bottom
R34  51.75,68.9 45 top
R35  43.61,44.77 90 bottom
R36  51.75,54.93 45 top
R37  36.04,43.34 180 bottom
R38  52.39,41.28 45 top
R39  26.35,49.05 270 bottom
R40  34.93,9.84 225 top
R41  23.81,47.94 270 bottom
R42  21.59,10.48 225 top
R43  27.62,42.7 45 bottom
R44  13.02,15.88 225 top
R45  26.19,38.73 315 bottom
R46  13.02,30 225 top
R47  25.4,54.13 0 bottom
R48  14.61,45.72 225 top
R49  11.75,56.83 180 bottom
R50  13.33,57.79 225 top
R51  -13.02,69.53 180 bottom  (outside the outline)
R52  -4.13,83.82 270 top  (outside the outline)
R105  1.91,66.99 270 bottom
R106  77.04,34.43 270 bottom  (outside the outline)
R107  81.69,90.86 0 bottom  (outside the outline)
R108  84.27,94.91 0 bottom  (outside the outline)
R109  143.51,50.8 270 bottom  (outside the outline)
R110  79.22,18.1 0 bottom  (outside the outline)
R111  3.81,66.99 270 bottom
R112  4.45,46.04 270 bottom
R113  71.28,9.05 180 bottom  (outside the outline)
R114  5.08,17.46 270 bottom
RE1  1.91,73.34 180 top
RE2  1.91,70.8 0 top
SJ1  77.31,43.5 55 bottom  (outside the outline)
VD14  25.13,77.61 180 bottom
VD15  36.56,75.8 270 bottom
VD16  53.15,80.24 270 bottom
VD17  52.55,66.99 270 bottom
VD18  48.74,56.88 180 bottom
VD19  47.94,43.18 180 bottom
VD20  55.72,8.73 90 bottom
VD21  31.27,16.67 90 bottom
VD22  29.21,26.83 180 bottom
VD23  31.27,29.37 0 bottom
VD24  16.51,53.5 90 bottom
VD25  10.48,60.96 90 bottom
VD26  -9.84,71.12 90 bottom  (outside the outline)
VD53  4.13,53.66 180 bottom
VD54  3.49,25.4 180 bottom
VT14  20.36,81.26 180 bottom
VT15  32.91,75.61 270 bottom
VT16  49.82,79.89 270 bottom
VT17  48.9,66.99 270 bottom
VT18  48.26,53.66 180 bottom
VT19  47.94,40.01 180 bottom
VT20  51.12,7.94 90 bottom
VT21  34.45,16.51 90 bottom
VT22  28.26,23.65 180 bottom
VT23  30.48,32.54 0 bottom
VT24  20.64,53.5 180 bottom
VT25  13.97,60.33 90 bottom
VT26  -6.98,83.19 90 bottom  (outside the outline)
VT53  3.49,49.85 180 bottom
VT54  3.81,21.91 180 bottom
XI2  88.9,-24.13 270 top  (outside the outline)
XI2B  92.08,-49.53 270 top  (outside the outline)
XN1  59.69,18.1 270 top
XN2  110.17,-36.19 270 top  (outside the outline)
XN3  121.29,-32.7 270 top  (outside the outline)
XN4  137.8,-36.19 270 top  (outside the outline)
XO1  70.17,-19.05 270 top  (outside the outline)
XO2A  95.25,-27.62 270 top  (outside the outline)
XO2B  115.25,-49.85 270 top  (outside the outline)
XO3  65.09,-15.56 0 top  (outside the outline)
XO4  70.17,-47.94 270 top  (outside the outline)
Z1  4.13,81.6 90 top

### Tracks (layer width: path | path; a pad name or v marks a point on that pad's centre or on a via)
+5V  (via drill 0.5 pad 1.02)  (19 unrouted)
  Top 0.406: v27.72,-18.73 v27.72,-33.34 v27.72,-45.3 | v49,-33.07 49.53,-32.53 49.53,-26.03 v49.21,-25.72
  Top 0.508: v49,-33.07 v49,-45.5
  Bottom 0.305: 27.3,-28.26 25.4,-26.35 | 27.3,-42.86 25.4,-40.96 DDD2.10 | 27.3,-35.24 DDD4.16 | DDD7.10 48.9,-42.86 47.36,-41.01 DDD5.10 | 23.5,-33.34 DDD2.16
  Bottom 0.406: v27.72,-18.73 DDD1.16 22.23,-18.73 C1.1 | DDD4.16 v27.72,-33.34 DDD2.16 | 27.3,-28.26 DDD3.10 | 29.84,-44.77 29.84,-43.5 28.89,-42.86 DDD4.10 27.3,-42.86 | DDD1.10 25.4,-26.35 | DDD5.16 v49,-33.07 | DDD6.16 46.46,-18.2 43.81,-15.56 28.89,-15.56 27.72,-16.73 v27.72,-18.73 | v27.72,-18.73 27.72,-20.64 DDD3.16 | DDD6.10 48.58,-26.35 v49.21,-25.72 | 20,-26.35 16.83,-26.35 16.19,-26.99 16.19,-28.26 16.83,-28.89 20,-28.89 20.64,-29.53
  Bottom 0.508: DDD7.10 50.8,-42.86 51.75,-43.5 51.75,-44.77 51.02,-45.5 v49,-45.5 | 29.84,-44.77 29.84,-45.4 | 29.84,-45.4 28.14,-45.4 v27.72,-45.3 | 49.21,-45.4 v49,-45.5 | v49,-33.07 49.31,-35.24 DDD7.16 | 29.84,-45.4 36.51,-45.4 36.83,-45.08 40.32,-45.08 40.64,-45.4 48.9,-45.4 v49,-45.5 | 20,-26.35 DDD1.10 | 20.64,-29.53 20.64,-32.7 | JP4.1 20.64,-32.7 | 20.64,-32.7 21.27,-33.34 23.5,-33.34 C2.1
+5VISP  (1 unrouted)
+100V
  Top 0.61: N35.A 33.11,6.26 32.07,7.3 29.21,7.3 28.17,6.26 N36.A 20.09,6.26 18.41,7.94 15.88,7.94 14.2,6.26 N37.A 8.06,8.3 10.8,11.04 10.8,13.65 8.06,16.39 N38.A 8.06,21.39 11.11,24.45 11.11,26.04 8.57,28.58 8.57,33.74 N39.A | 60.22,85.09 49.38,85.09 N30.A 46.93,85.79 45.72,87 37.28,87 N29.A | 60.22,85.09 N32.A N33.A N34.A | 60.22,85.09 N31.A | N41.A 36.08,79.49 N29.A | N29.A 32.93,80.24 15.88,63.18 15.88,59.69 11.43,55.25 11.43,51.63 N40.A | N40.A 11.75,48.26 13.02,46.99 13.02,39.22 N39.A | N40.A | N28.A 1.91,34.26 | 1.91,36.51 N27.A 1.91,35.24 1.91,34.26 | N39.A 1.91,34.26
B1  (1 unrouted)
B2  (1 unrouted)
B3  (1 unrouted)
B4  (1 unrouted)
B5  (1 unrouted)
B6  (1 unrouted)
B7
  Bottom 0.61: N35.K 31.77,4.01 R40.2
B8
  Bottom 0.61: N36.K 19.07,4.01 R42.2
B9
  Bottom 0.61: N37.K 10.3,9.61 R44.2
B10  (1 unrouted)
B11  (1 unrouted)
B12  (1 unrouted)
E1
  Bottom 0.406: R112.2 N27.K
E2
  Bottom 0.61: N28.K R114.2
GND  (via drill 0.5 pad 1.02, 0.5 pad 1.27)  (57 unrouted)
  Top 0.406: v31.01,-44.13 v31.01,-29.53 | v22.54,-37.15 24.13,-37.15 24.77,-36.51 v24.77,-28.89 v24.77,-16.83 23.81,-17.78 23.81,-19.37 22.54,-20.64 v22.54,-22.54 | v45.09,-43.5 v45.09,-47.31 | v52.7,-47.31 52.7,-44.45 v53.03,-44.13 53.03,-29.22 v52.7,-28.89 52.7,-23.81 51.44,-22.54 v50.48,-22.54
  Top 0.508: v5.72,40.32 4.76,40.32 3.49,41.59 3.49,42.86 5.72,45.09 v5.72,51.12
  Bottom 0.305: DDD3.13 27.3,-24.45 25.4,-22.54 DDD1.13 | DDD4.13 27.3,-39.05 25.4,-37.15 DDD2.13 | DDD7.13 48.9,-39.05 47.36,-37.2 DDD5.13
  Bottom 0.406: 30.8,-42.33 DDD2.8 31.01,-42.23 v31.01,-44.13 DDD4.8 35.24,-44.13 36.51,-43.18 37.78,-42.55 38.1,-42.55 | DDD2.13 v22.54,-37.15 21.27,-37.15 19.68,-35.24 JP4.2 | v22.54,-22.54 DDD1.13 | v31.01,-29.53 DDD3.8 | v31.01,-29.53 31.01,-27.62 DDD1.8 | v31.01,-29.53 29.11,-30.8 26.67,-30.8 25.72,-30.16 C2.2 24.76,-29.21 v24.77,-28.89 | DDD7.8 v53.03,-44.13 53.03,-42.28 DDD5.8 | v52.7,-28.89 52.7,-27.94 DDD6.8 | DDD5.13 43.45,-37.2 40.96,-38.1 40.32,-38.1 38.1,-40.32 38.1,-42.55 | v45.09,-43.5 41.59,-43.5 40.64,-42.55 38.1,-42.55 | DDD6.13 v50.48,-22.54 | C1.2 24.45,-16.51 v24.77,-16.83 | v45.09,-47.31 45.4,-47.62 52.39,-47.62 v52.7,-47.31 | VT53.E 4.61,51.12 v5.72,51.12 5.72,53.55 VD53.A
  Bottom 0.61: VT54.E 5.19,23.44 VD54.A 5.19,39.8 v5.72,40.32 | VD53.A 5.83,73.55 4.13,75.25
N$1  (via drill 3 pad 4)  (2 unrouted)
  other vias: 54.93,27.31 22.23,87 3.81,7.3
N$3  (1 unrouted)
N$16  (1 unrouted)
N$17  (1 unrouted)
N$30  (2 unrouted)
N$31  (1 unrouted)
N$32  (2 unrouted)
N$33  (1 unrouted)
N$34  (1 unrouted)
N$35  (2 unrouted)
N$36  (1 unrouted)
N$37  (2 unrouted)
N$38  (1 unrouted)
N$39  (2 unrouted)
N$40  (1 unrouted)
N$41  (2 unrouted)
N$42  (1 unrouted)
N$43  (2 unrouted)
N$44  (1 unrouted)
N$45  (2 unrouted)
N$46  (1 unrouted)
N$47  (2 unrouted)
N$48  (1 unrouted)
N$49  (2 unrouted)
N$50  (1 unrouted)
N$51  (2 unrouted)
N$52  (1 unrouted)
N$53  (2 unrouted)
N$54  (1 unrouted)
N$55  (2 unrouted)
N$72  (2 unrouted)
N$73
  Bottom 0.406: VT53.C R112.1
N$76  (2 unrouted)
N$84
  Bottom 0.406: VT53.B 2.43,51.06 VD53.C 2.43,54.82 3.81,56.2 R111.2
N$112  (2 unrouted)
N$113
  Bottom 0.61: R114.1 VT54.C
N$114  (1 unrouted)
N$115  (1 unrouted)
N$116
  Bottom 0.406: VD54.C 1.79,39.26 3.49,40.96 3.49,43.18 2.22,44.45 2.22,47.62 0.95,48.9 0.95,54.93 1.91,55.88 R105.2
  Bottom 0.61: VD54.C 1.79,24.08 VT54.B
N$117  (1 unrouted)
N$118  (1 unrouted)
N$119  (1 unrouted)
R1  (via drill 0.5 pad 1.02)  (8 unrouted)
  Top 0.305: v39.69,-16.51 v39.69,-36.51 v39.69,-46.36 | v54.29,-41.01 54.29,-46.04 v53.98,-46.36
  Top 0.406: v26.35,-20 26.35,-17.46 26.99,-16.83 v29.53,-16.83
  Bottom 0.305: DDD2.5 31.43,-38.42 33.34,-36.51 DDD4.2 v39.69,-36.51 | v26.35,-20 DDD1.15 | DDD5.7 v54.29,-41.01 | v39.69,-16.51 29.84,-16.51 v29.53,-16.83 | v53.98,-46.36 51.75,-46.36 51.44,-46.67 46.35,-46.67 46.04,-46.36 v39.69,-46.36
  Bottom 0.406: v39.69,-16.51 42.23,-16.51
R2  (via drill 0.5 pad 1.02)  (7 unrouted)
  Top 0.305: v38.73,-37.78 v38.73,-17.46
  Bottom 0.305: DDD2.6 31.43,-39.69 33.34,-37.78 DDD4.3 v38.73,-37.78 | DDD1.1 31.43,-18.73 31.43,-18.1 32.38,-17.14 37.46,-17.14 v38.73,-17.46 39.69,-18.41 43.18,-18.41 44.77,-20 DDD6.15
  Bottom 0.406: DDD6.15 49.21,-20 50.16,-19.05 50.16,-18.1 51.12,-17.14
R3  (via drill 0.5 pad 1.02)  (7 unrouted)
  Top 0.305: v37.78,-39.05 v37.78,-18.41 37.78,-16.83 39.37,-15.24 v52.6,-15.24
  Bottom 0.305: DDD2.7 31.43,-40.96 33.34,-39.05 DDD4.4 v37.78,-39.05 | DDD1.2 31.75,-20 32.7,-18.41 33.34,-18.1 37.46,-18.1 v37.78,-18.41 39.05,-19.37 42.23,-19.37 | DDD6.1 v52.6,-15.24
R4  (via drill 0.5 pad 1.02)  (6 unrouted)
  Top 0.305: v36.2,-40.32 35.88,-40 v35.88,-19.37
  Bottom 0.305: DDD1.3 31.75,-21.27 33.02,-19.37 v35.88,-19.37 | DDD4.5 v36.2,-40.32
  Bottom 0.406: DDD3.15 DDD1.3 | v35.88,-19.37 36.83,-19.37 39.05,-20.32 42.23,-20.32
R5  (via drill 0.5 pad 1.02)  (6 unrouted)
  Top 0.305: v36.83,-20.64 36.83,-18.73 36.51,-18.41 35.24,-18.41 34.93,-18.73 34.93,-39.69 33.02,-41.59 v32.38,-41.59
  Bottom 0.305: DDD1.4 31.75,-22.54 33.02,-20.64 DDD3.1 v36.83,-20.64 | v32.38,-41.59 DDD4.6
  Bottom 0.406: v36.83,-20.64 38.73,-21.27 42.23,-21.27
R6  (via drill 0.5 pad 1.02)  (6 unrouted)
  Top 0.305: v36.83,-21.91 36.83,-39.69 37.15,-40 37.15,-41.27 v36.83,-41.59
  Bottom 0.305: DDD1.5 31.75,-23.81 33.02,-21.91 DDD3.2 v36.83,-21.91 37.15,-22.22 41.91,-22.22
  Bottom 0.406: DDD4.7 35.24,-42.86 36.51,-41.59 v36.83,-41.59
R7  (via drill 0.5 pad 1.02)  (4 unrouted)
  Top 0.305: v50.48,-24.45 v50.48,-33.66 | v43.81,-34.61 43.81,-26.35 43.18,-25.72 v43.18,-23.18
  Bottom 0.305: DDD1.6 31.75,-25.08 33.34,-23.18 DDD3.3 41.59,-23.18 | DDD5.15 44.5,-34.66 v43.81,-34.61 | v43.18,-23.18 42.23,-23.18 | v50.48,-24.45 51.12,-23.81 DDD6.5
  Bottom 0.406: 41.59,-23.18 42.23,-23.18 | v50.48,-33.66 50.48,-32.38 49.85,-31.75 45.09,-31.75 43.81,-33.02 v43.81,-34.61
R8  (via drill 0.5 pad 1.02)  (5 unrouted)
  Top 0.305: v54.61,-31.11 v54.61,-25.08
  Bottom 0.305: DDD1.7 31.75,-26.35 33.34,-24.45 DDD3.4 42.23,-24.45 | DDD5.1 52.97,-33.39 v54.61,-31.11 | v54.61,-25.08 DDD6.6
R9  (via drill 0.5 pad 1.02)  (4 unrouted)
  Top 0.305: v32.07,-28.58 v32.07,-31.43 | v26.67,-34.29 v26.67,-32.38 | v55.56,-32.38 v55.56,-26.35
  Bottom 0.305: v32.07,-28.58 32.38,-26.99 33.34,-25.72 DDD3.5 42.23,-25.72 42.23,-27.3 43.81,-28.89 50.48,-28.89 50.8,-28.58 50.8,-26.67 51.12,-26.35 DDD6.7 v55.56,-26.35 | v32.07,-31.43 29.84,-31.43 28.57,-31.75 27.3,-31.75 v26.67,-32.38 | DDD5.2 53.29,-34.66 v55.56,-32.38
  Bottom 0.406: DDD2.15 26.35,-34.61 v26.67,-34.29
R10  (5 unrouted)
  Bottom 0.305: DDD2.1 34.93,-33.34 37.15,-30.8 | 37.15,-30.8 37.15,-27.94 36.2,-26.99 DDD3.6 | 37.15,-30.8 42.23,-30.8 | DDD7.15 DDD5.3 53.29,-35.93 54.93,-33.97 57.47,-33.97
R11  (5 unrouted)
  Bottom 0.305: DDD2.2 29.84,-34.61 28.89,-33.66 28.89,-32.7 29.21,-32.38 34.61,-32.38 36.2,-30.48 36.2,-28.89 35.56,-28.26 DDD3.7 | DDD5.4 53.29,-37.2 55.24,-35.24 DDD7.1
R12  (7 unrouted)
  Bottom 0.305: DDD4.15 28.89,-36.51 29.84,-35.88 DDD2.3 31.43,-35.88 33.02,-34.29 42.55,-34.29 | DDD5.5 53.29,-38.47 55.24,-36.51 DDD7.2
R13  (7 unrouted)
  Bottom 0.305: DDD2.4 31.43,-37.15 33.34,-35.24 DDD4.1 42.55,-35.24 | DDD5.6 53.29,-39.74 55.24,-37.78 DDD7.3
RCLOCK  (via drill 0.5 pad 1.02)
  Top 0.305: v42.86,-41.91 v42.86,-48.26 | v20.64,-48.26 v20.64,-39.69
  Top 0.406: v20.64,-39.69 v20.64,-25.08 | v44.45,-39.74 44.77,-39.42 44.77,-25.4 v44.45,-25.08
  Bottom 0.305: DDD3.11 27.3,-26.99 25.4,-25.08 DDD1.11 | DDD4.11 27.3,-41.59 25.4,-39.69 DDD2.11 | DDD7.11 48.9,-41.59 47.36,-39.74 DDD5.11 | 46.3,-39.69 DDD5.11 | DDD6.11 v44.45,-25.08 | DDD5.11 v44.45,-39.74 44.45,-40.96 43.5,-41.91 v42.86,-41.91 | v42.86,-48.26 v20.64,-48.26
  Bottom 0.406: DDD1.11 v20.64,-25.08 | DDD2.11 v20.64,-39.69
  Bottom 0.508: JP2.3 v20.64,-25.08
RCLOCK_MISO_D12  (1 unrouted)
RDATA_MOSI_D11  (1 unrouted)
RE1
  Bottom 0.61: R111.1 3.81,72.71 3.17,73.34 RE1.1
RE2
  Bottom 0.61: RE2.1 R105.1
RESET  (2 unrouted)
RLATCH  (via drill 0.5 pad 1.02)
  Top 0.305: v44.45,-23.81 45.4,-23.81 45.72,-24.13 45.72,-40.32 45.09,-40.96 43.81,-40.96 v43.81,-47.31 | v21.59,-47.31 v21.59,-38.42
  Top 0.406: v21.59,-38.42 v21.59,-23.81 | 43.81,-40.96 43.18,-40.32 43.18,-39.1 v43.81,-38.47
  Bottom 0.305: DDD3.12 27.3,-25.72 25.4,-23.81 DDD1.12 | DDD4.12 27.3,-40.32 25.4,-38.42 DDD2.12 | DDD7.12 48.9,-40.32 47.36,-38.47 DDD5.12 v43.81,-38.47 | DDD6.12 v44.45,-23.81 | v43.81,-47.31 v21.59,-47.31
  Bottom 0.406: DDD1.12 v21.59,-23.81 | DDD2.12 v21.59,-38.42
  Bottom 0.508: v21.59,-23.81 20.32,-22.54 JP2.2
SCK  (1 unrouted)
SCL  (3 unrouted)
SCL_J  (1 unrouted)
SDA  (3 unrouted)
SEQ  (3 unrouted)
SEQ_J  (1 unrouted)
SER0  (1 unrouted)
  Bottom 0.305: DDD1.14 25.4,-21.27 27.3,-23.18 DDD3.14
  Bottom 0.406: DDD1.14 20.32,-21.27 18.73,-20
  Bottom 0.508: JP2.1 18.73,-20
SER1  (via drill 0.5 pad 1.02)  (2 unrouted)
  Top 0.305: v22.54,-27.62 v22.54,-35.88
  Top 0.406: v47.94,-36.51 47.94,-27.94 v48.26,-27.62
  Bottom 0.305: DDD1.9 25.4,-27.62 26.99,-29.53 DDD3.9 | DDD4.14 27.3,-37.78 25.4,-35.88 | DDD7.14 48.9,-37.78 v47.94,-36.51 | v48.26,-27.62 DDD6.9
  Bottom 0.406: 25.4,-35.88 DDD2.14 v22.54,-35.88 | v22.54,-27.62 DDD1.9
SER2  (via drill 0.5 pad 1.02)
  Top 0.305: v37.78,-43.81 v37.78,-46.36
  Bottom 0.305: DDD4.9 27.3,-44.13 26.99,-43.81 | 26.99,-43.81 25.4,-42.23 DDD2.9 | v37.78,-46.36 27.3,-46.36 26.67,-45.72 26.67,-44.13 26.99,-43.81 | 46.35,-44.13 46.04,-44.45 41.27,-44.45 40.64,-43.81 v37.78,-43.81
  Bottom 0.406: DDD2.9 23.18,-42.23 20,-40.64 | DDD7.9 46.35,-44.13 46.25,-44.03 DDD5.9
  Bottom 0.508: 20,-40.64 16.51,-37.15 16.51,-31.75 18.1,-30.16 JP2.5
VBAT  (3 unrouted)

### Text on the board
tPlace: IP/2